# EasyEDA Pro project ESP32_BT-WiFi_Board.eprj

# Schematic MyTouchPad

## Sheets
1 主控最小系统: Create Date: 2024-08-18; Page Name: 主控最小系统; Project Name: ESP32_BT-WiFi_Board; Schematic Name: MyTouchPad; Update Date: 2024-08-21; Company: 嘉立创EDA; Page Size: A4; Version: V1.0
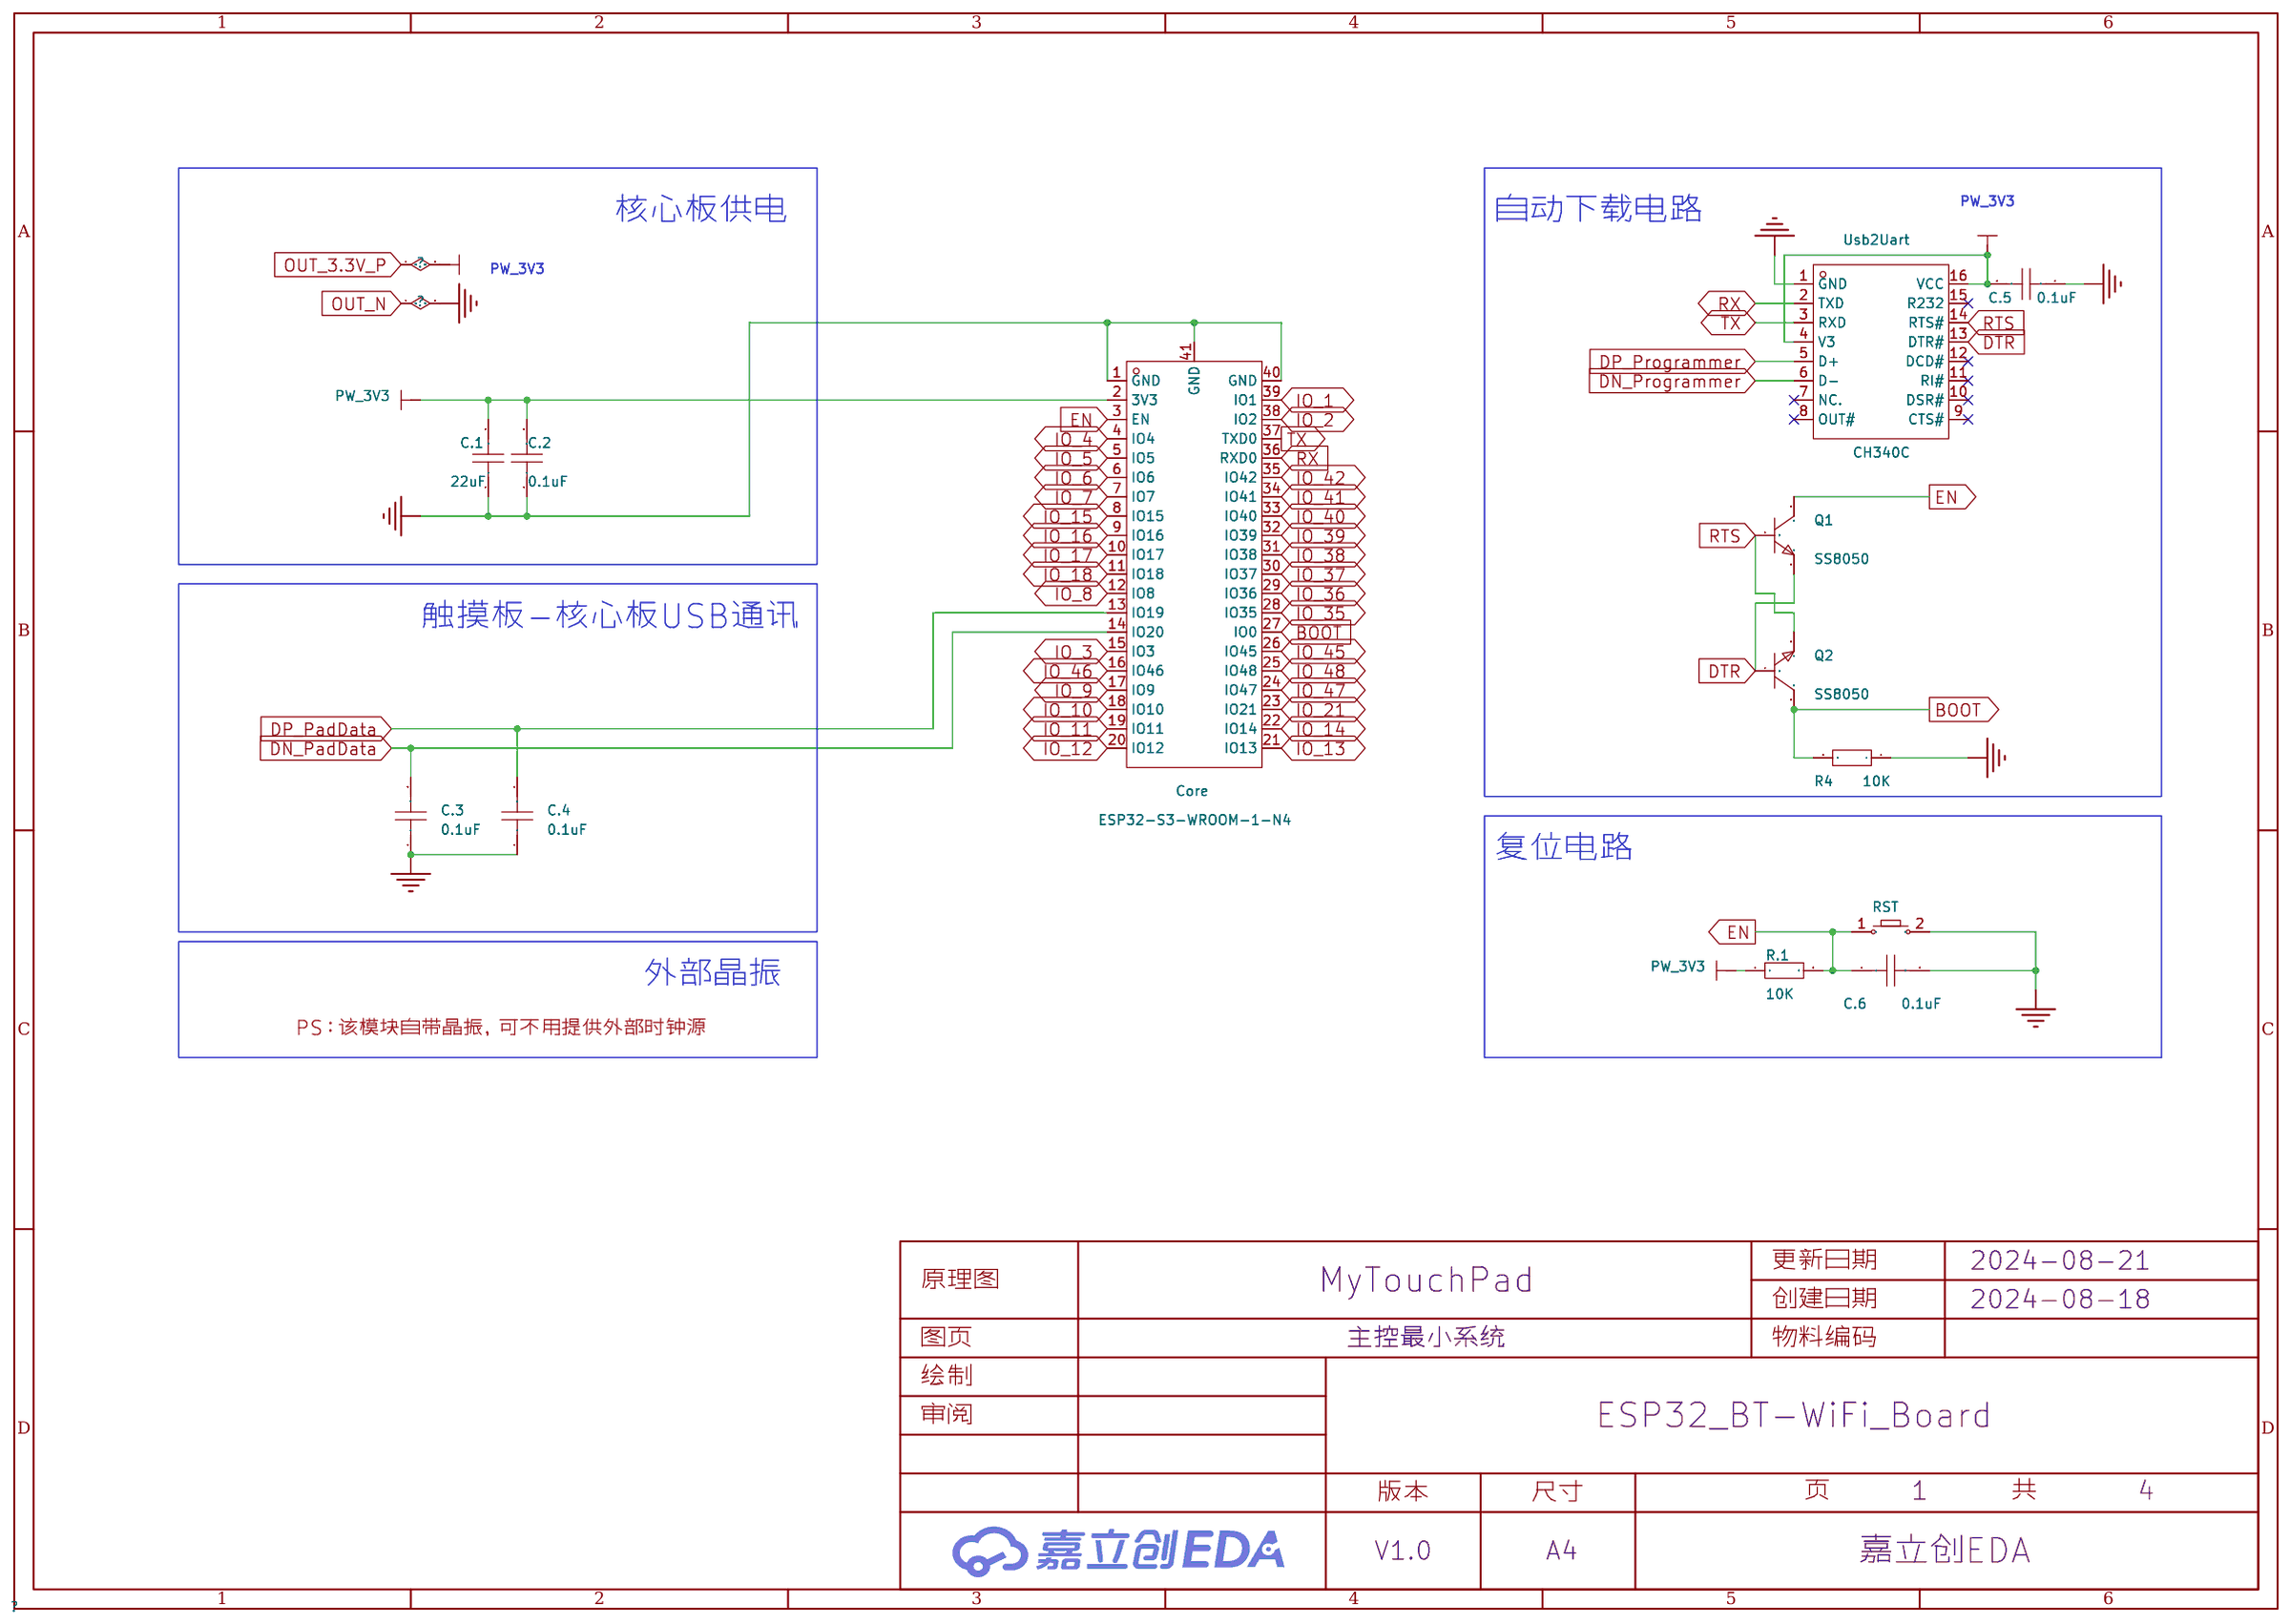
[diagram p0: 主控最小系统]
2 供电源: Page Name: 供电源; Update Date: 2024-08-19
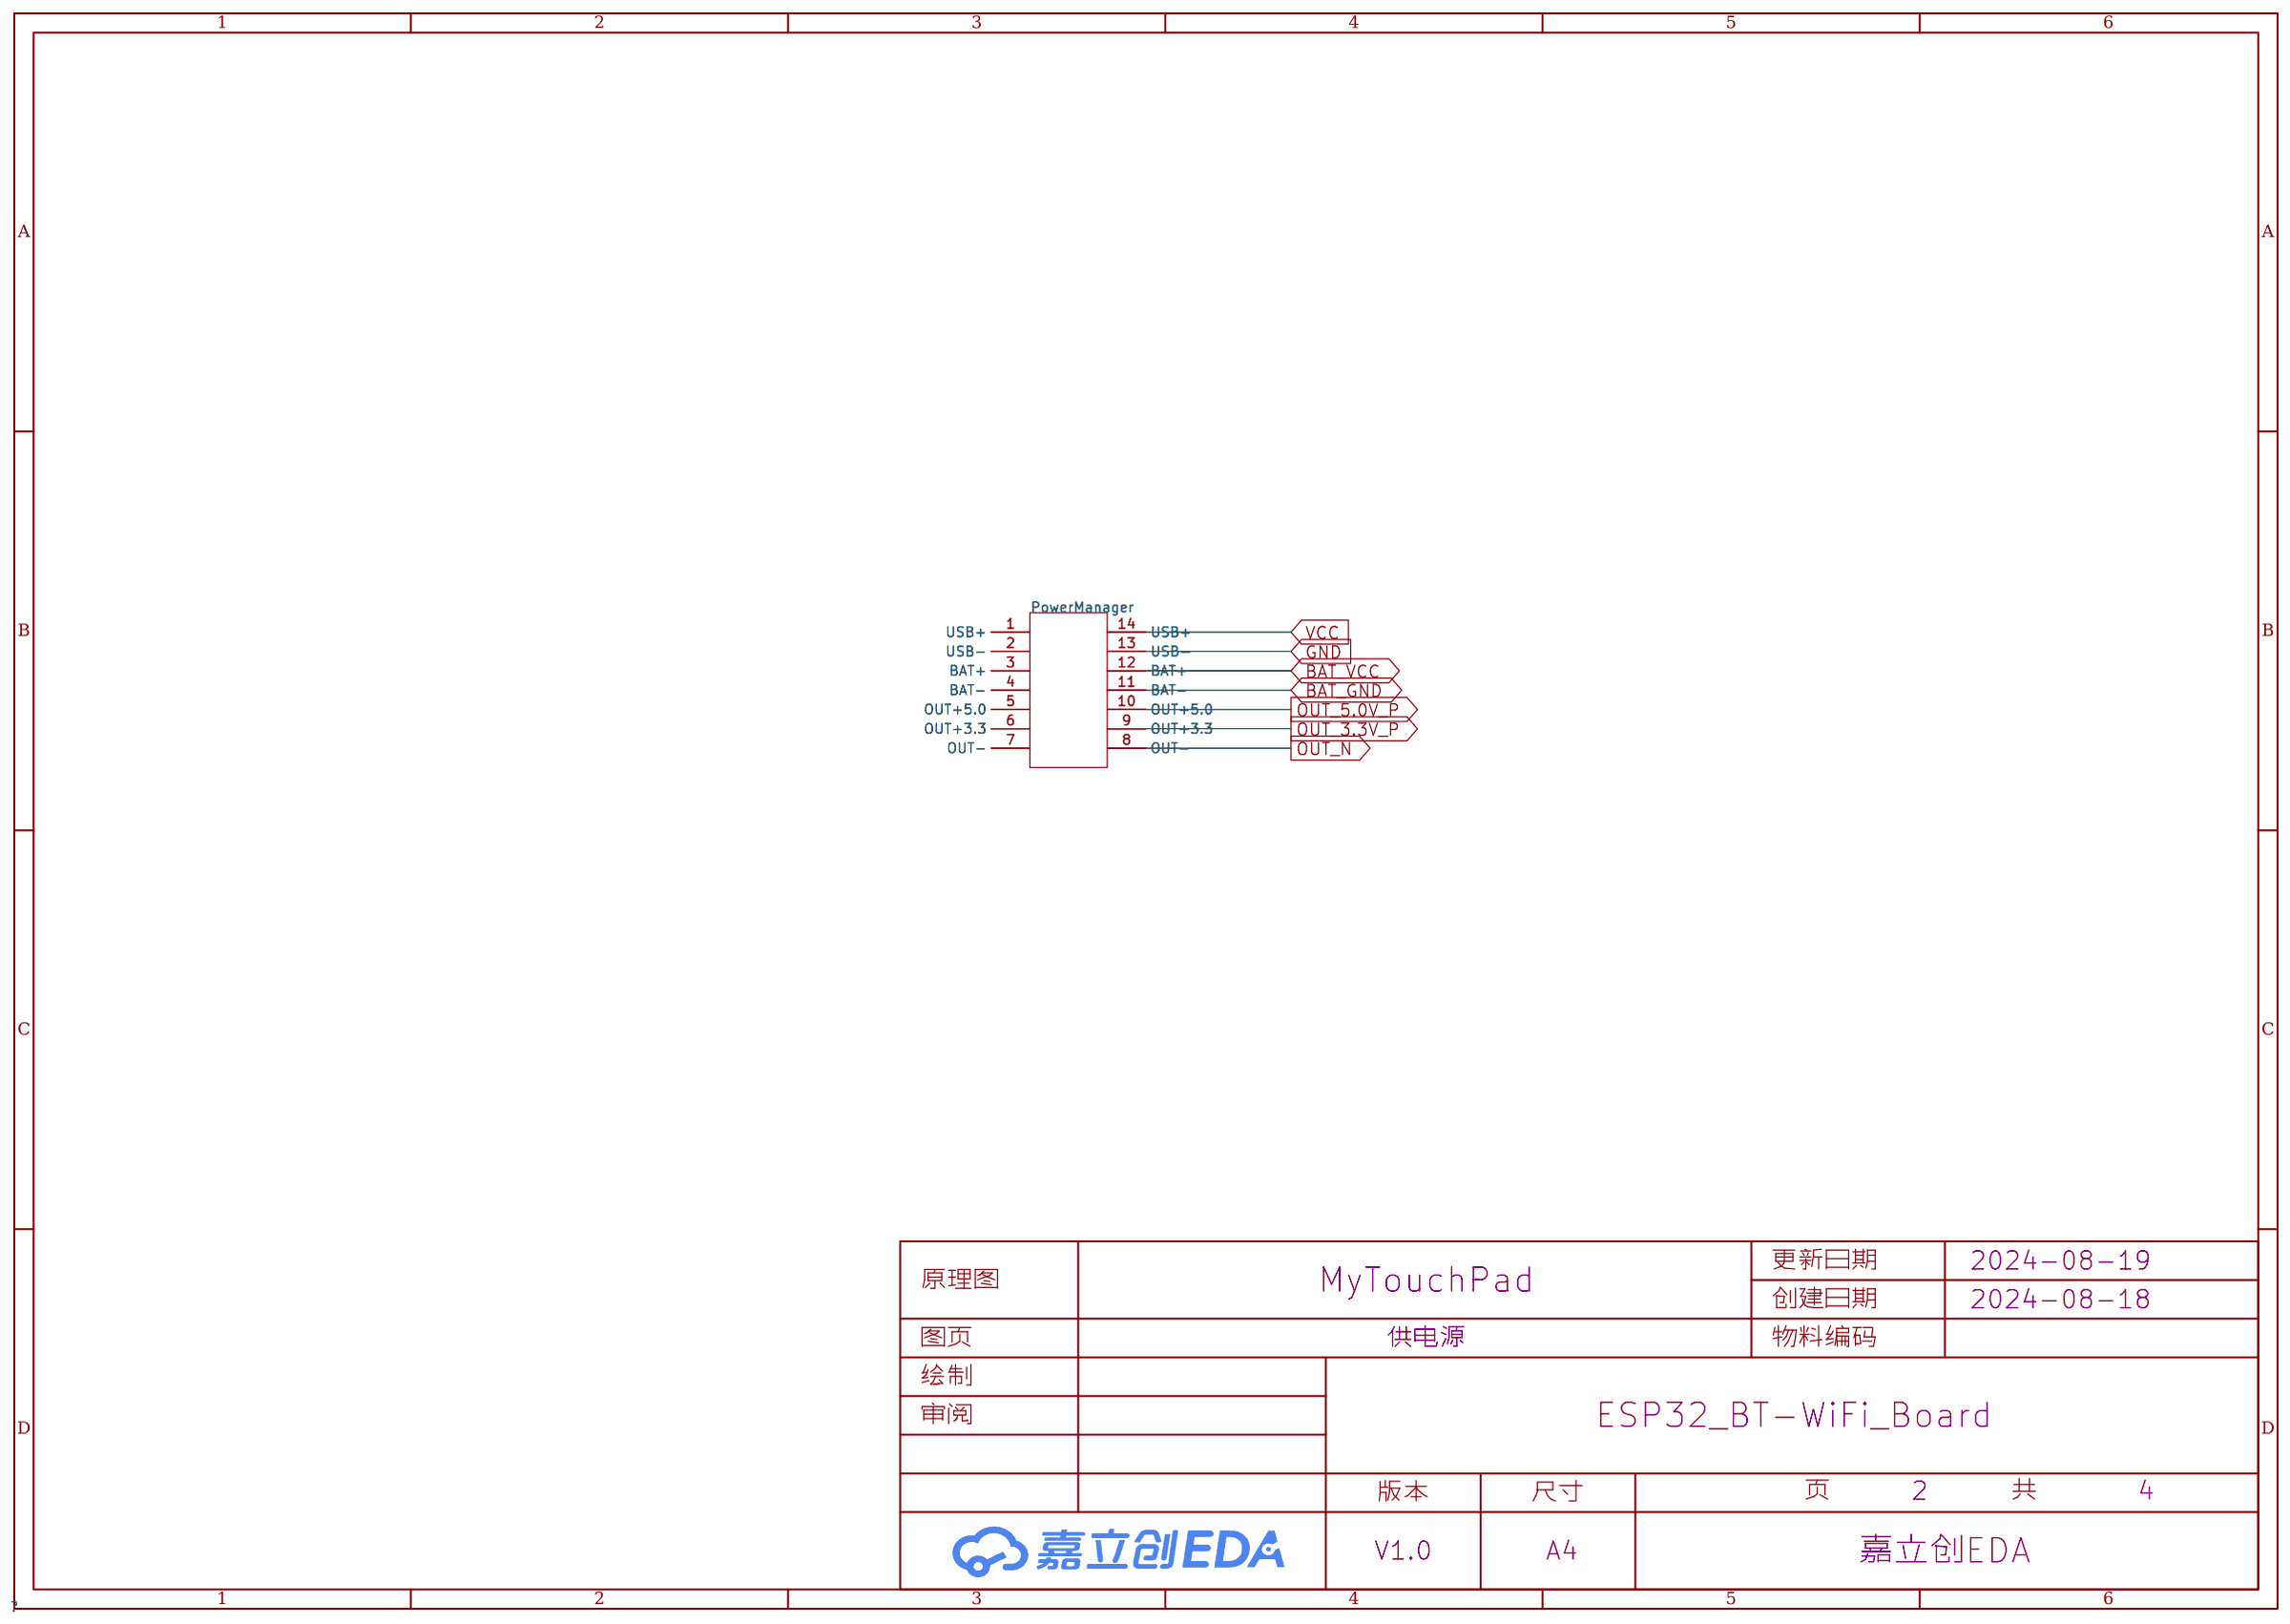
[diagram p1: 供电源]
3 触摸板模块: Page Name: 触摸板模块
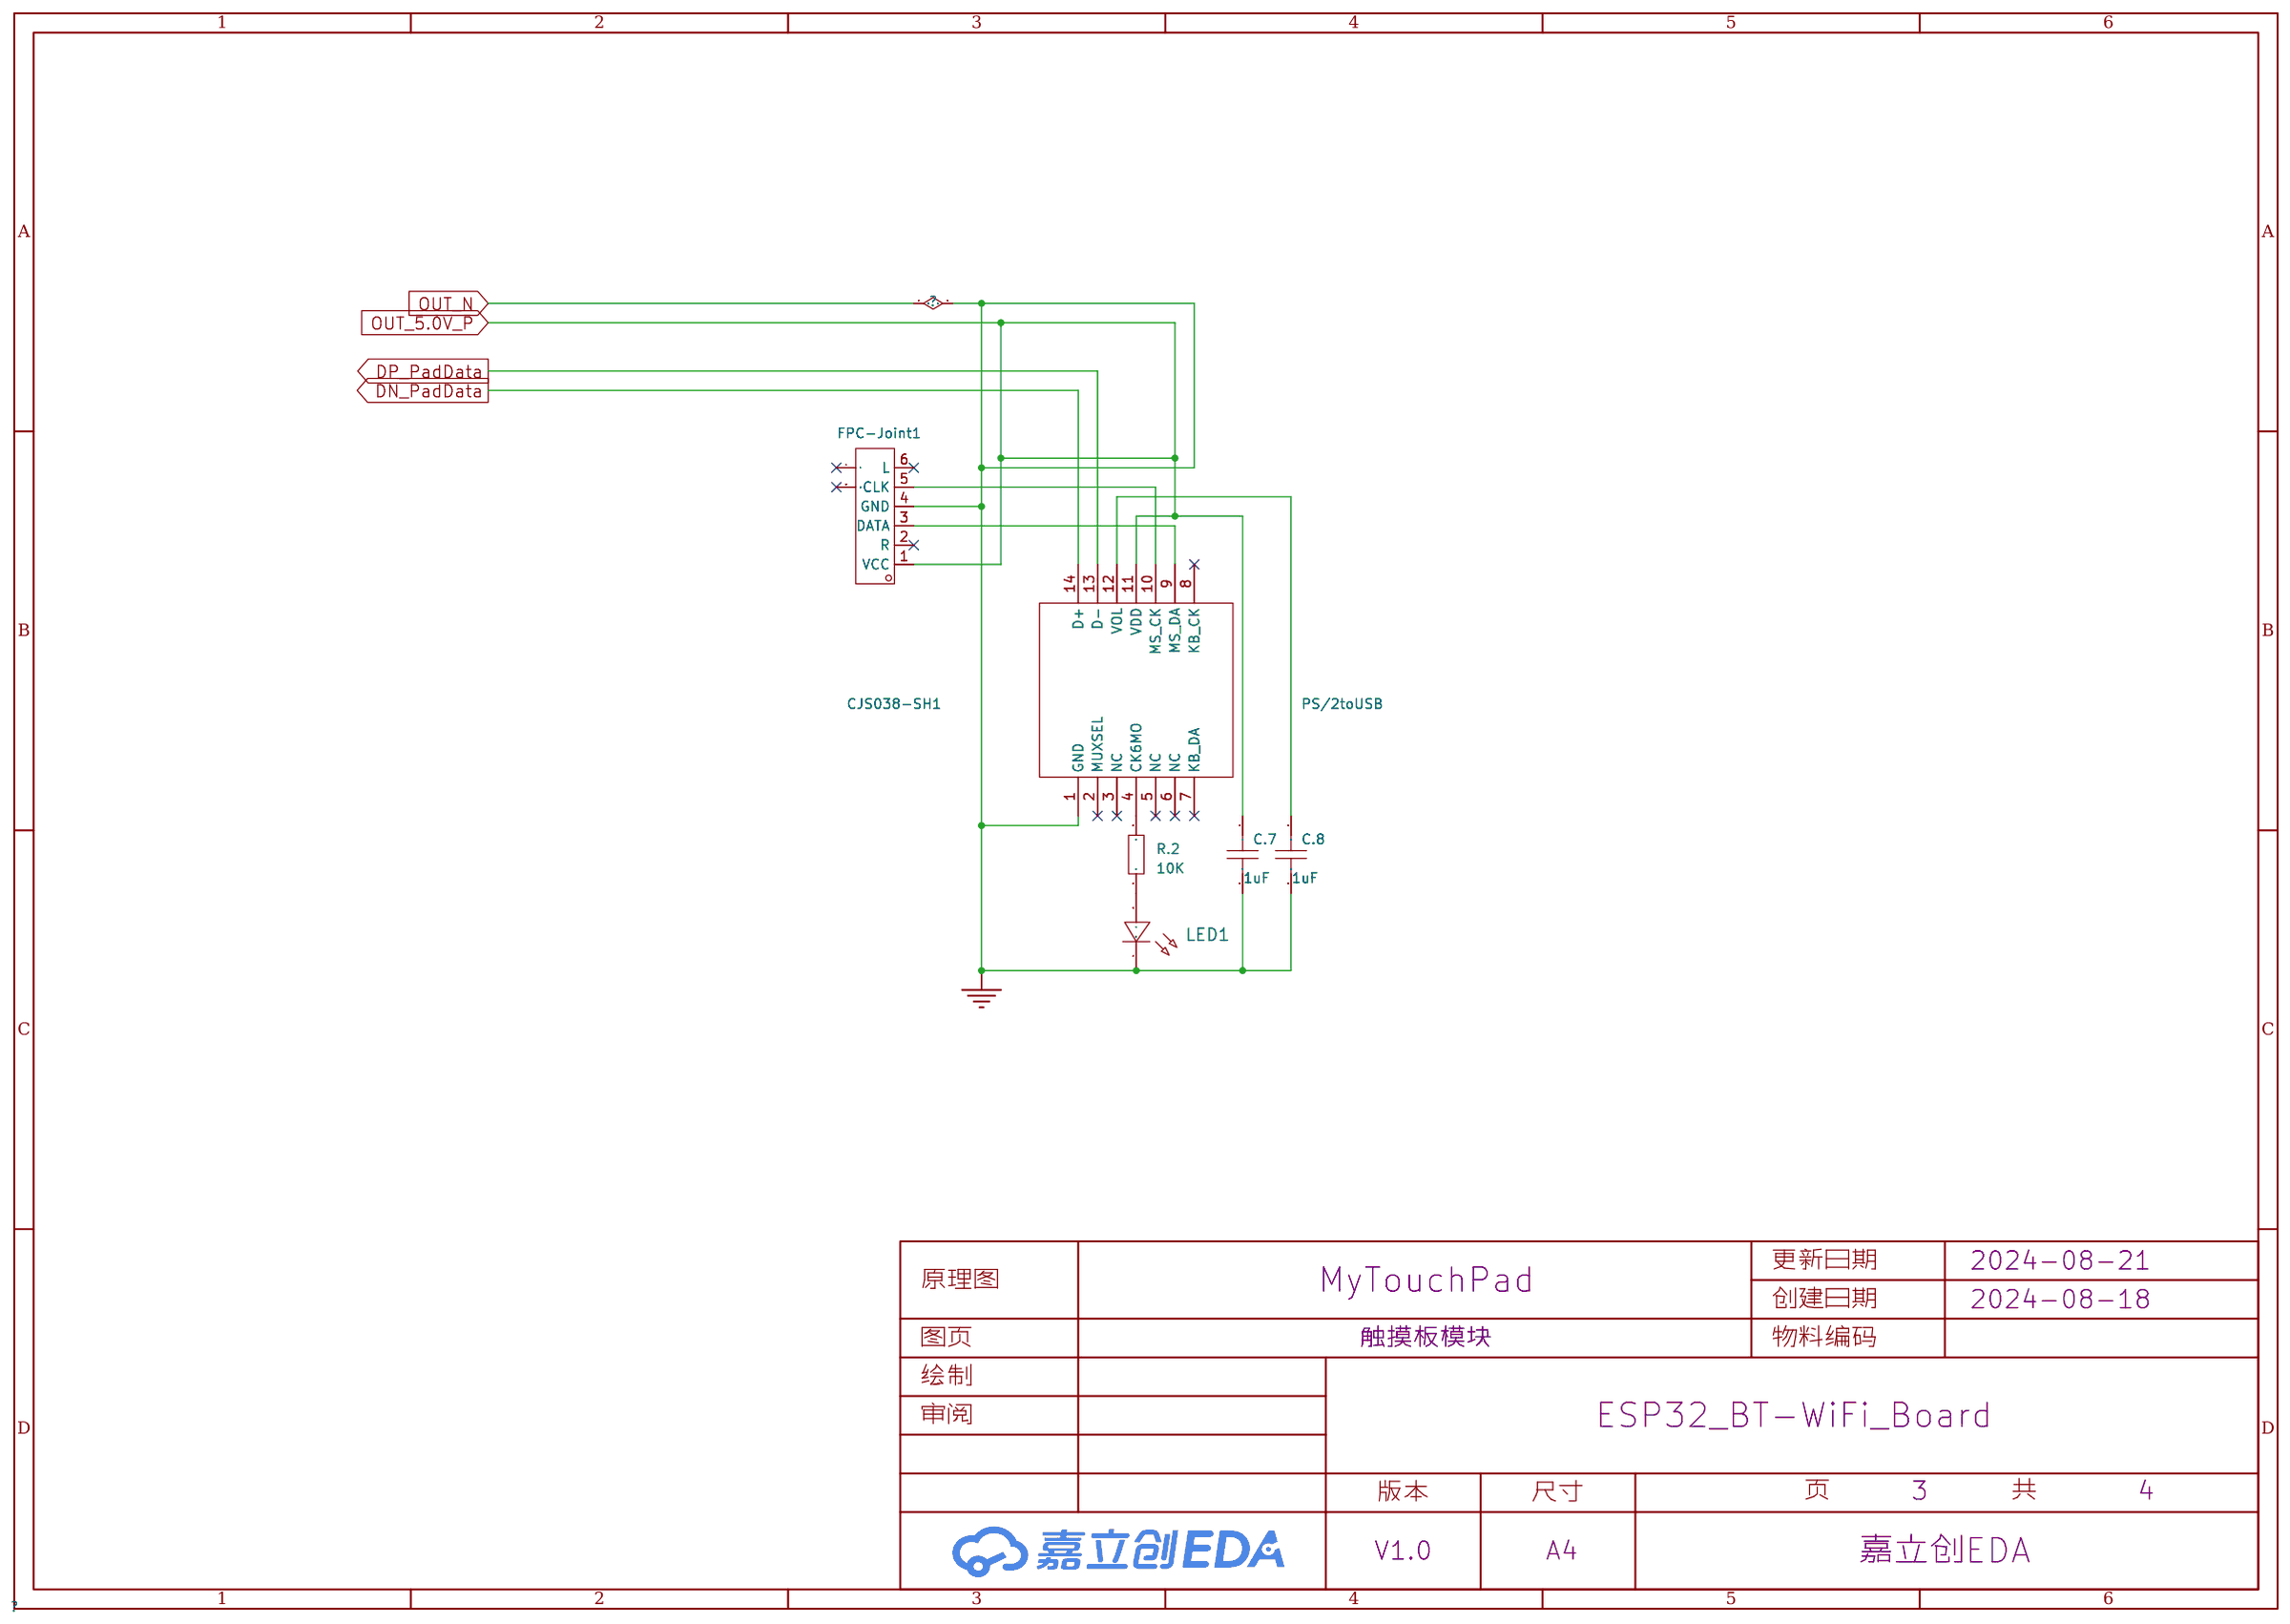
[diagram p2: 触摸板模块]
4 其它外设: Page Name: 其它外设
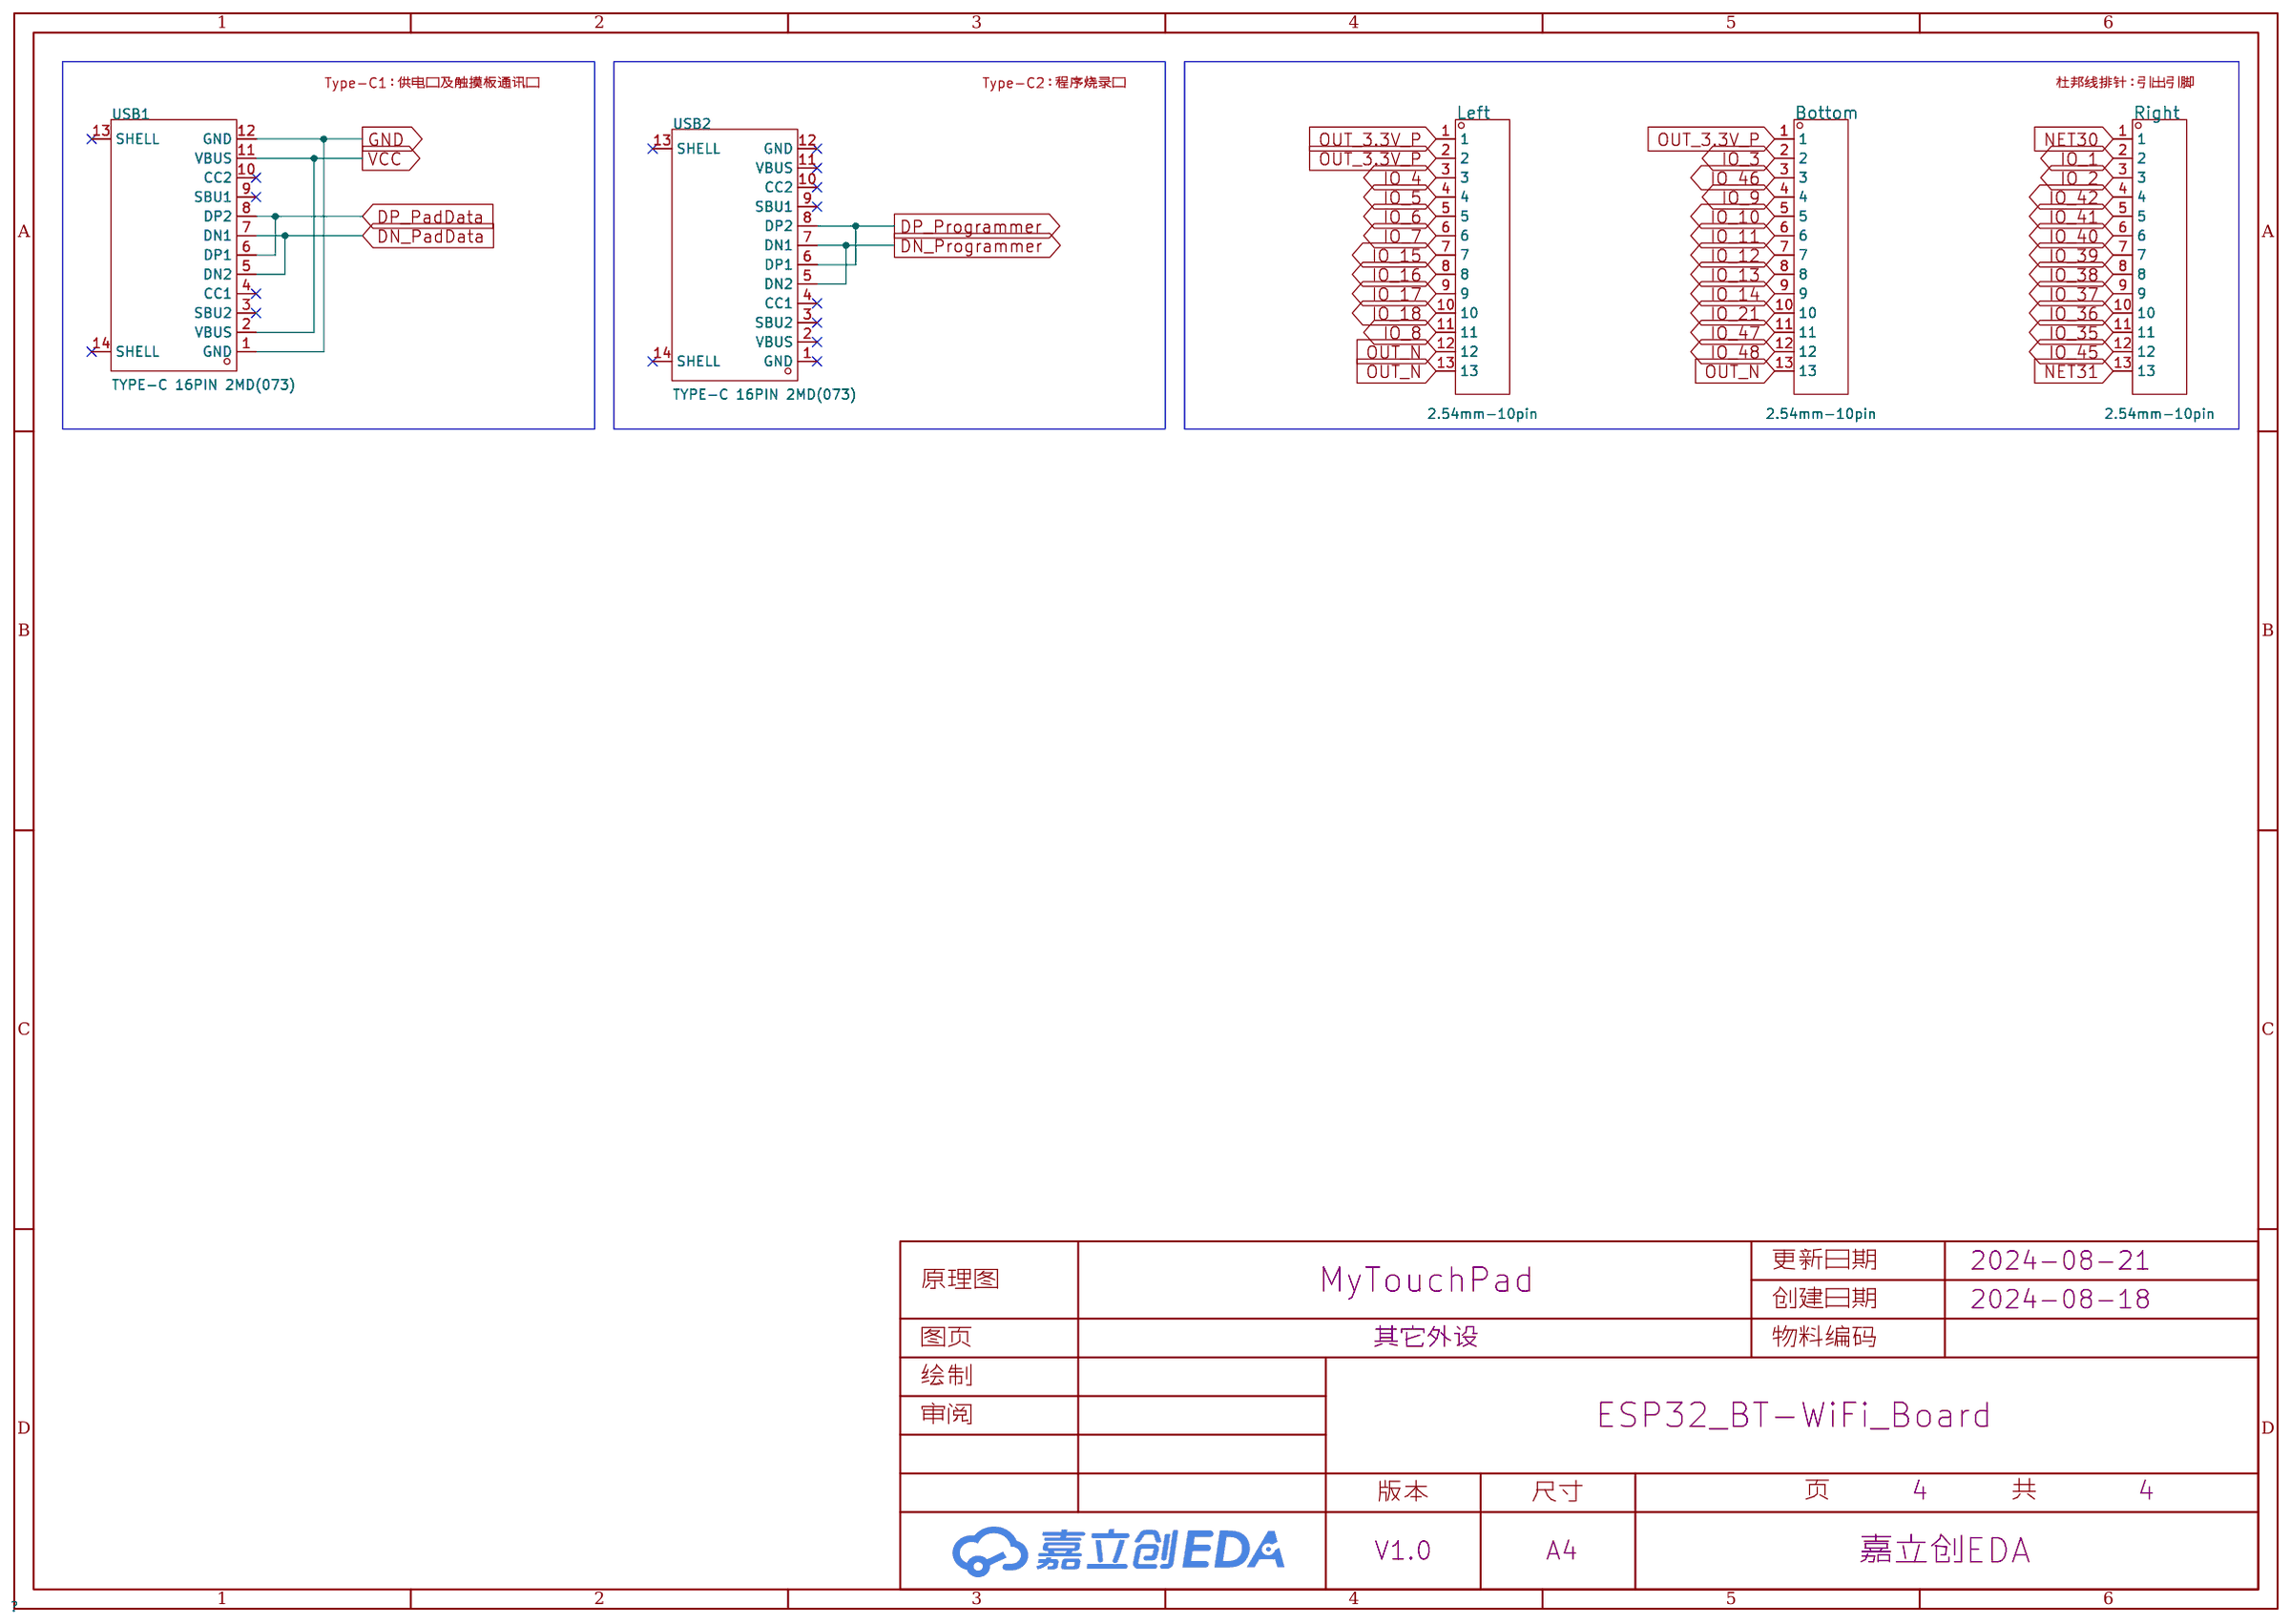
[diagram p3: 其它外设]

## Parts
sheet 主控最小系统
C.1  22uF  [C0603]
C.2  0.1uF  [C0603]
C.3  0.1uF  [C0603]
C.4  0.1uF  [C0603]
C.5  0.1uF  [C0603]
C.6  0.1uF  [C0603]
Core  ESP32-S3-WROOM-1-N4  [WIFIM-SMD_ESP32-S3-WROOM-1-N8]
Q1  SS8050  [SOT-23-3_L2.9-W1.3-P1.90-LS2.4-BR]
Q2  SS8050  [SOT-23-3_L2.9-W1.3-P1.90-LS2.4-BR]
R4  10K  [R0603]
R.1  10K  [R0603]
RST  -  [Key_SMD_3x4x2]
Usb2Uart  CH340C  [SOP-16_L10.0-W3.9-P1.27-LS6.0-BL]
sheet 供电源
PowerManager  -  [PowerManager]
sheet 其它外设
Bottom  2.54mm-10pin  [HDR-TH_13P-P2.54-H-M-W10.0]
Left  2.54mm-10pin  [HDR-TH_13P-P2.54-H-M-W10.0]
Right  2.54mm-10pin  [HDR-TH_13P-P2.54-H-M-W10.0]
USB1  TYPE-C 16PIN 2MD(073)  [USB-C-SMD_TYPE-C-6PIN-2MD-073]
USB2  TYPE-C 16PIN 2MD(073)  [USB-C-SMD_TYPE-C-6PIN-2MD-073]
sheet 触摸板模块
C.7  1uF  [C0603]
C.8  1uF  [C0603]
CJS038-SH1  PS/2toUSB  [CJS038-SH]
FPC-Joint1  VCC  [FPC-SMD_C47271]
LED1  -  [LED_0603]
R.2  10K  [R0603]

## Library data of the parts
C.1-C.8 = CAP_0603: Supplier Footprint: 0603
Core = ESP32-S3-WROOM-1-N4: LCSC Part Name: 通用型Wi-Fi+低功耗蓝牙MCU模组; Supplier Part: C2913197; Manufacturer: ESPRESSIF(乐鑫); Supplier Footprint: SMD,18x25.5mm; JLCPCB Part Class: 扩展库; Datasheet: https://atta.szlcsc.com/upload/public/pdf/source/20220628/A2AC12B3C87735CAEB7EBE2DBE80936C.pdf; Supplier: LCSC
Q1 Q2 = SS8050_C2150: 晶体管类型:NPN;集电极电流(Ic):1.5A;集射极击穿电压(Vceo):25V;功率(Pd):300mW;直流电流增益(hFE@Ic,Vce):200@100mA,1V;; LCSC Part Name: SS8050(RANGE:200-350) hfe=200~350; Supplier Part: C2150; Manufacturer: CJ(江苏长电/长晶); Supplier Footprint: SOT-23; Datasheet: https://atta.szlcsc.com/upload/public/pdf/source/20230322/AEE86F4B043774EFF80CAEA14A37D9E9.pdf; Supplier: LCSC; Transistor Type: NPN; Collector Current (Ic): 1.5A; Collector-Emitter Breakdown Voltage (Vceo): 25V; Power Dissipation (Pd): 300mW; DC Current Gain (hFE@Ic,Vce): 200@100mA,1V; Transition Frequency (fT): 100MHz; Collector Cut-Off Current (Icbo): 100nA; Collector-Emitter Saturation Voltage (VCE(sat)@Ic,Ib): 500mV@800mA,80mA
R4 R.1 R.2 = Res_0603: Supplier Footprint: 0603
RST = Key_SMD_3x4x2: Supplier Footprint: SMD
Usb2Uart = CH340C: 应用功能:收发器;接口协议:USB 2.0;数据速率:2Mbps;; LCSC Part Name: CH340C USB转串口芯片 CH340; Supplier Part: C84681; Manufacturer: WCH(南京沁恒); Supplier Footprint: SOP-16; Datasheet: https://atta.szlcsc.com/upload/public/pdf/source/20200819/C84681_ADBED554CE321879DBD6B1D06488689C.pdf; Supplier: LCSC; Applications Function: 收发器; Protocol: USB 2.0; Supply Voltage: 3.3V；5V; Data Rate: 2Mbps
PowerManager = PowerManagerBoard
Bottom Left Right = 排针2.54: 插针结构:1x13P;间距:2.54mm;行距:-;圆针/方针:方针;安装类型:弯插;排数:单排;总PIN位数:13P;额定电流:-;额定电压:-;配合针长度:6.7mm;塑高:-;触头材质:黄铜;触头镀层:-;工作温度范围:-55℃~+105℃;颜色:黑色;; LCSC Part Name: 间距:2.54mm 1x13P 弯插 方针; Supplier Part: C53043; Manufacturer: BOOMELE(博穆精密); Supplier Footprint: 弯插,P=2.54mm; JLCPCB Part Class: 扩展库; Datasheet: https://atta.szlcsc.com/upload/public/pdf/source/20190227/C53043_9E66E3B03BAF8C9BE00E32CFB7075A29.pdf; Supplier: LCSC; Pin Structure: 1x13P; Pitch: 2.54mm; Circluar Pins/Square Pins: 方针; Mounting Type: 弯插; Number of Rows: 单排; Number of Pins: 13P; Length of Mating Pin: 6.7mm; Contact Material: 黄铜; Operating Temperature Range: -55℃~+105℃; Color: 黑色
USB1 USB2 = TYPE-C 16PIN 2MD(073): 连接器类型:Type-C;标准:-;公母:母;端口数量:1;触点数量:16P;安装方式:卧贴;额定电流 - 电源:5A;工作温度范围:-25℃~+85℃;; LCSC Part Name: Type-C 母 卧贴; Supplier Part: C2765186; Manufacturer: SHOU HAN(首韩); Supplier Footprint: SMD; Datasheet: https://atta.szlcsc.com/upload/public/pdf/source/20211123/39B17C16241EAC15C5E277BDA434118E.pdf; Supplier: LCSC; Connector Type: Type-C; Gender: 母; Number of Ports: 1; Number of Contacts: 16P; Mounting Style: 卧贴; Current Rating - Power (Max): 5A; Operating Temperature Range: -25℃~+85℃
CJS038-SH1 = CJS038-SH: 协议转换芯片，将PS/2信号转换成USB信号
FPC-Joint1 = 1.0-6P上接: 锁定特性:抽屉式;触点类型:上接;触点数量:6P;间距:1mm;安装类型:卧贴;工作温度范围:-25℃~+85℃;; LCSC Part Name: 间距:1mm P数:6P 抽屉式 上接; Supplier Part: C47271; Manufacturer: BOOMELE(博穆精密); Supplier Footprint: SMD,P=1mm,卧贴; Datasheet: https://atta.szlcsc.com/upload/public/pdf/source/20231027/443F616BA0A67C4DA05E58DE2BCDE40A.pdf; Supplier: LCSC; Locking Feature: 抽屉式; Contact Type: 上接; Number of Contacts: 6P; Pitch: 1mm; Mounting Type: 卧贴; FFC, FCB Thickness: 0.3mm; Height Above Board: 2.8mm; Operating Temperature Range: -25℃~+85℃
LED1 = LED_0603-R: Supplier Footprint: 0603

## Nets
GND: PowerManager.13(USB-) USB1.1(GND) USB1.12(GND)
VCC: PowerManager.14(USB+) USB1.2(VBUS) USB1.11(VBUS)
BAT_GND: PowerManager.11(BAT-)
BAT_VCC: PowerManager.12(BAT+)
BOOT: Core.27(IO0) Q2.3(C) R4.2
DN_PadData: C.3.2 CJS038-SH1.14(D+) Core.14(IO20) USB1.5(DN2) USB1.7(DN1)
DN_Programmer: USB2.5(DN2) USB2.7(DN1) Usb2Uart.6(D-)
DP_PadData: C.4.2 CJS038-SH1.13(D-) Core.13(IO19) USB1.6(DP1) USB1.8(DP2)
DP_Programmer: USB2.6(DP1) USB2.8(DP2) Usb2Uart.5(D+)
DTR: Q1.2(E) Q2.1(B) Usb2Uart.13(DTR#)
EN: C.6.1 Core.3(EN) Q1.3(C) R.1.2 RST.1
IO_1: Core.39(IO1) Right.2
IO_2: Core.38(IO2) Right.3
IO_3: Bottom.2 Core.15(IO3)
IO_4: Core.4(IO4) Left.3
IO_5: Core.5(IO5) Left.4
IO_6: Core.6(IO6) Left.5
IO_7: Core.7(IO7) Left.6
IO_8: Core.12(IO8) Left.11
IO_9: Bottom.4 Core.17(IO9)
IO_10: Bottom.5 Core.18(IO10)
IO_11: Bottom.6 Core.19(IO11)
IO_12: Bottom.7 Core.20(IO12)
IO_13: Bottom.8 Core.21(IO13)
IO_14: Bottom.9 Core.22(IO14)
IO_15: Core.8(IO15) Left.7
IO_16: Core.9(IO16) Left.8
IO_17: Core.10(IO17) Left.9
IO_18: Core.11(IO18) Left.10
IO_21: Bottom.10 Core.23(IO21)
IO_35: Core.28(IO35) Right.11
IO_36: Core.29(IO36) Right.10
IO_37: Core.30(IO37) Right.9
IO_38: Core.31(IO38) Right.8
IO_39: Core.32(IO39) Right.7
IO_40: Core.33(IO40) Right.6
IO_41: Core.34(IO41) Right.5
IO_42: Core.35(IO42) Right.4
IO_45: Core.26(IO45) Right.12
IO_46: Bottom.3 Core.16(IO46)
IO_47: Bottom.11 Core.24(IO47)
IO_48: Bottom.12 Core.25(IO48)
NET30: Right.1
NET31: Right.13
OUT_5.0V_P: C.7.1 CJS038-SH1.11(VDD) FPC-Joint1.1(VCC) PowerManager.10(OUT+5.0)
PW_3V3: Bottom.1 C.1.2 C.2.2 C.5.2 Core.2(3V3) Left.1 Left.2 PowerManager.9(OUT+3.3) R.1.1 Usb2Uart.4(V3) Usb2Uart.16(VCC)
PW_GND: Bottom.13 C.1.1 C.2.1 C.3.1 C.4.1 C.5.1 C.6.2 C.7.2 C.8.2 CJS038-SH1.1(GND) Core.1(GND) Core.40(GND) Core.41(GND) FPC-Joint1.4(GND) LED1.1(C) Left.12 Left.13 PowerManager.8(OUT-) R4.1 RST.2 Usb2Uart.1(GND)
RTS: Q1.1(B) Q2.2(E) Usb2Uart.14(RTS#)
RX: Core.36(RXD0) Usb2Uart.2(TXD)
TX: Core.37(TXD0) Usb2Uart.3(RXD)
$3N416: CJS038-SH1.10(MS_CK) FPC-Joint1.5(CLK)
$3N417: CJS038-SH1.9(MS_DA) FPC-Joint1.3(DATA)
Net-(C.8-1): C.8.1 CJS038-SH1.12(VOL)
Net-(CJS038-SH1-4): CJS038-SH1.4(CK6MO) R.2.2
Net-(LED1-2): LED1.2(A) R.2.1

Not connected (* = marked no-connect by the designer): CJS038-SH1 2(MUXSEL)* 3(NC)* 5(NC)* 6(NC)* 7(KB_DA)* 8(KB_CK)*; FPC-Joint1 2(R)* 6(L)* 7* 8*; PowerManager 1(USB+) 2(USB-) 3(BAT+) 4(BAT-) 5(OUT+5.0) 6(OUT+3.3) 7(OUT-); USB1 3(SBU2)* 4(CC1)* 9(SBU1)* 10(CC2)* 13(SHELL)* 14(SHELL)*; USB2 1(GND)* 2(VBUS)* 3(SBU2)* 4(CC1)* 9(SBU1)* 10(CC2)* 11(VBUS)* 12(GND)* 13(SHELL)* 14(SHELL)*; Usb2Uart 7(NC.)* 8(OUT#)* 9(CTS#)* 10(DSR#)* 11(RI#)* 12(DCD#)* 15(R232)*

## Notes on the sheets
sheet 1
- 核心板供电
- 自动下载电路
- 触摸板-核心板USB通讯
- 复位电路
- 外部晶振
- PS：该模块自带晶振，可不用提供外部时钟源
sheet 4
- Type-C1：供电口及触摸板通讯口
- Type-C2：程序烧录口
- 杜邦线排针：引出引脚

# Schematic PowerManager
Create Date: 2024-08-25; Page Name: PowerManager; Project Name: ESP32_BT-WiFi_Board; Schematic Name: PowerManager; Update Date: 2024-08-25; Company: 嘉立创EDA; Page Size: A4; Version: V1.0
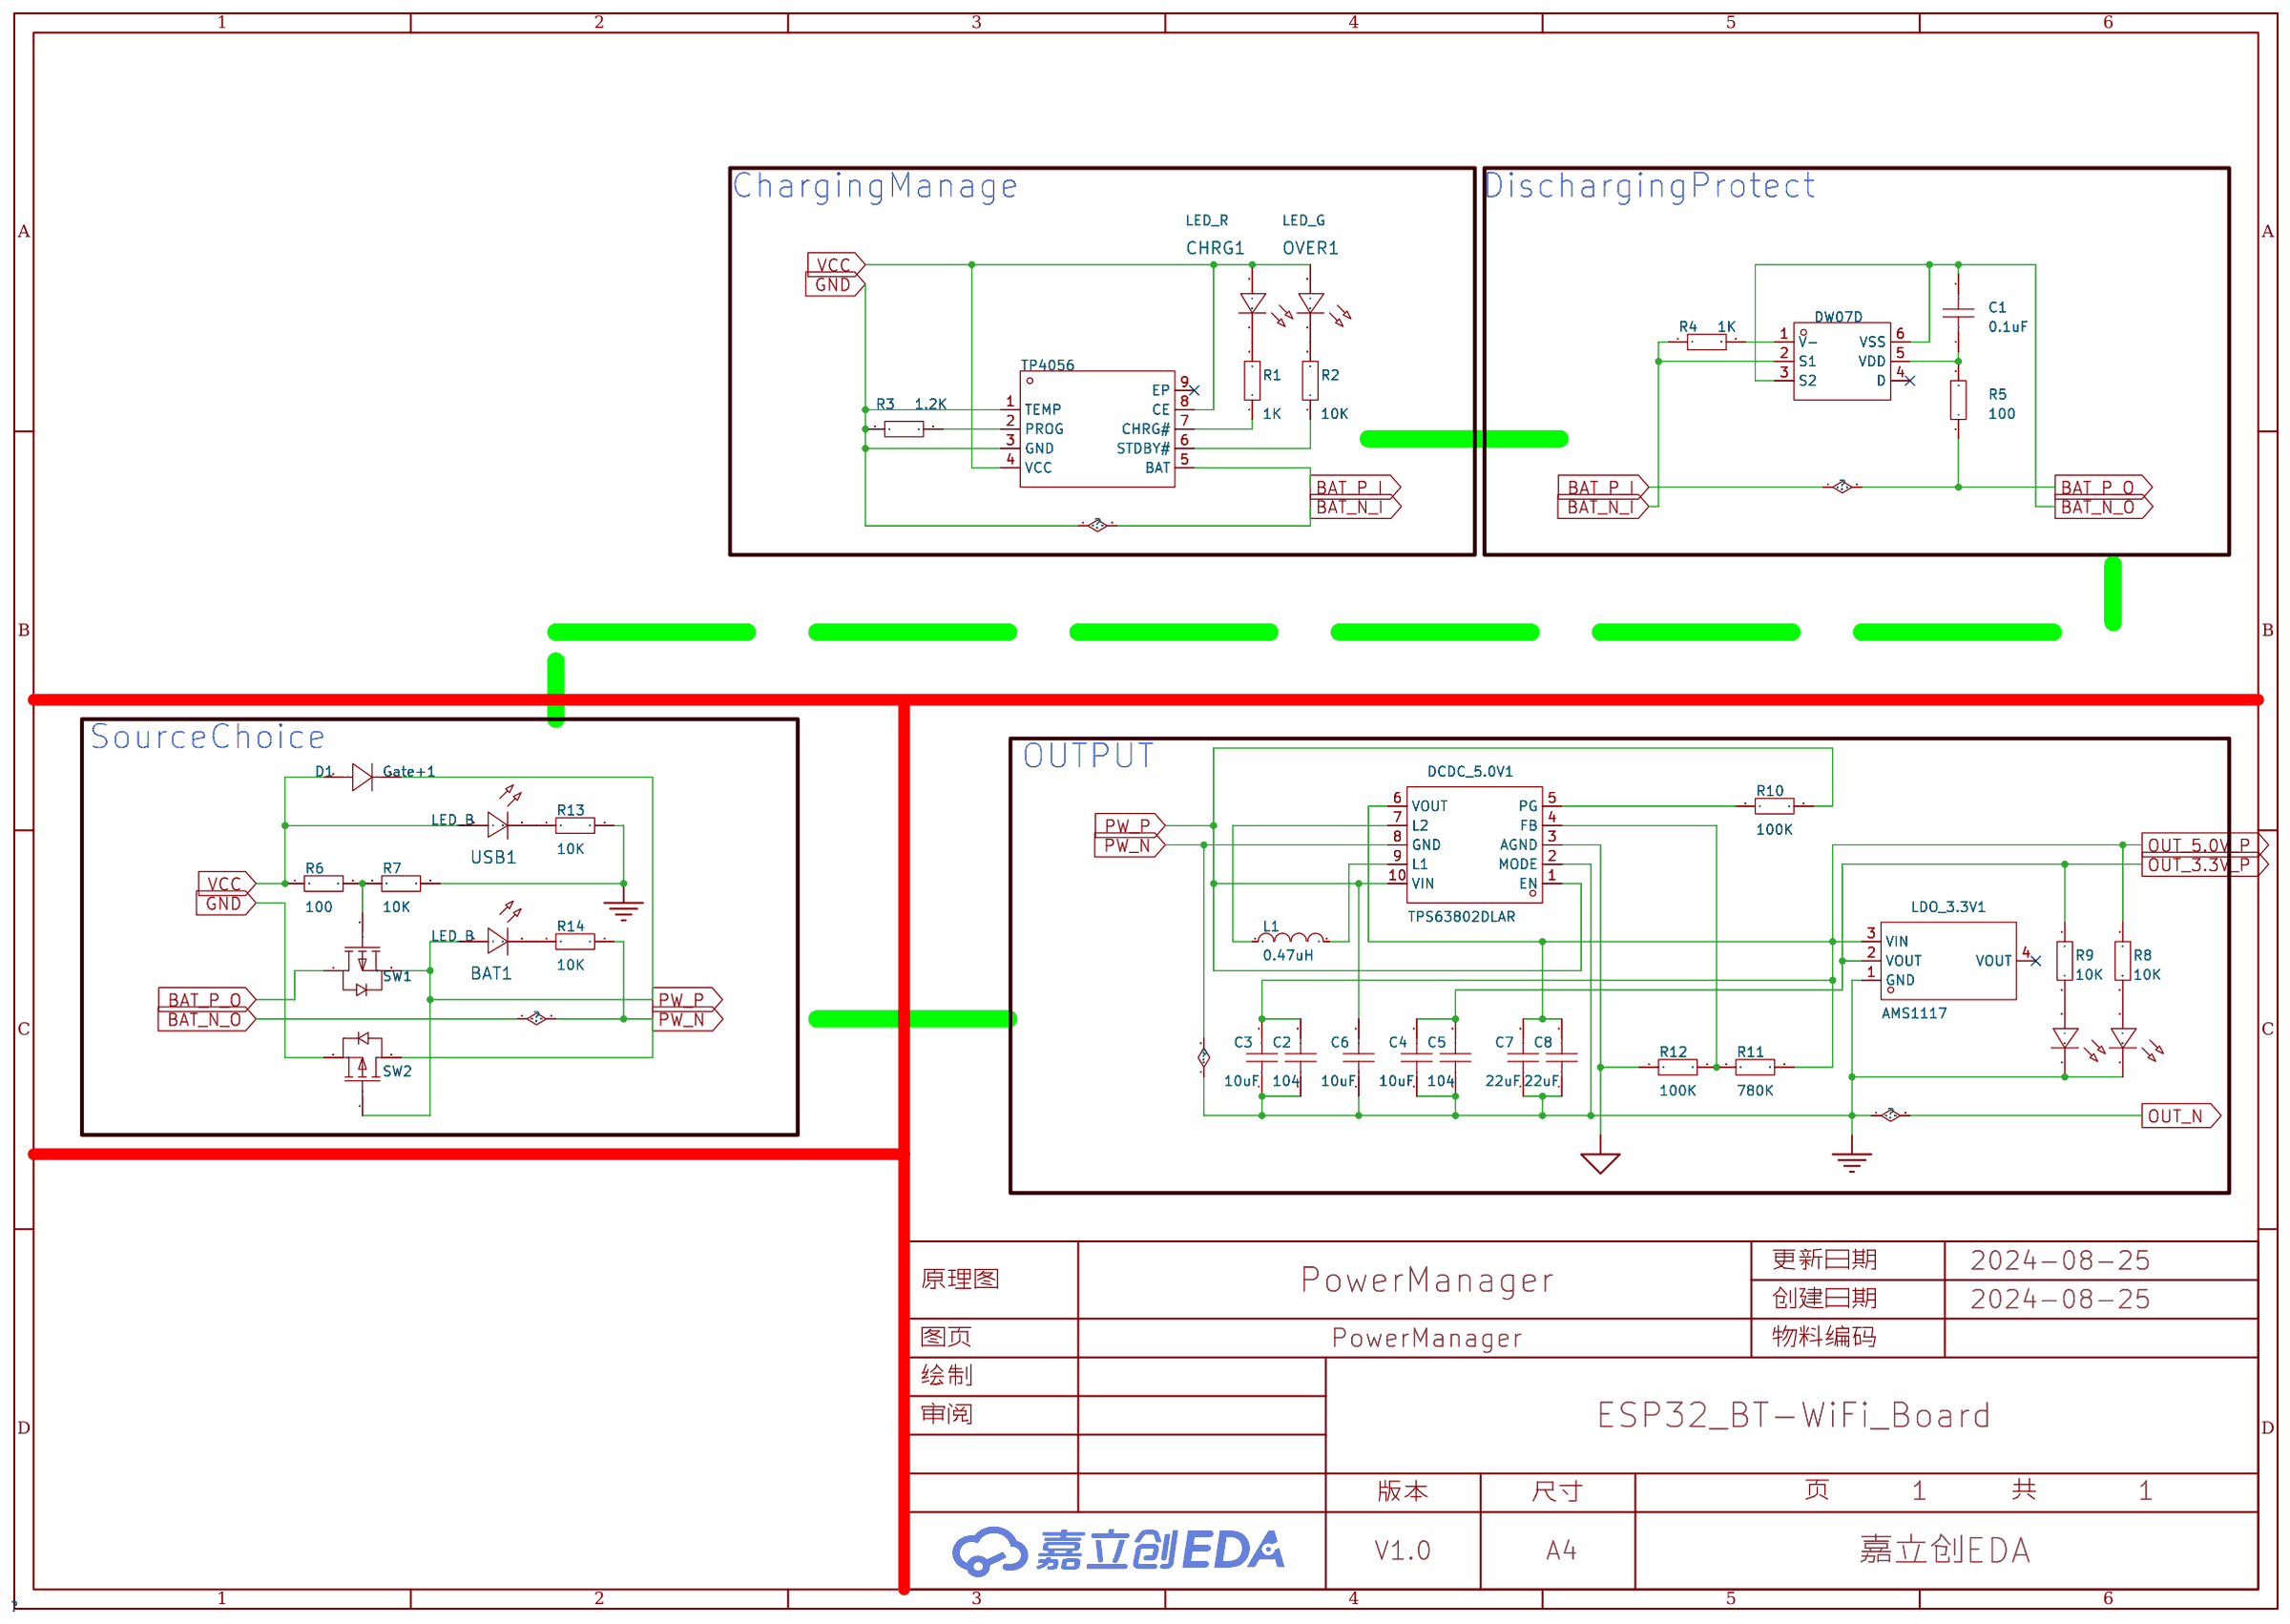
[diagram p4: schematic sheet]

## Parts
3.3V1  XL-1608UWC-04  [LED0603-RD_WHITE]
5.0V1  XL-1608UWC-04  [LED0603-RD_WHITE]
BAT1  LED_B  [LED0603-RD_BLUE]
C1  0.1uF  [C0603]
C2  104  [C0603]
C3  10uF  [C0603]
C4  104  [C0603]
C5  10uF  [C0603]
C6  10uF  [C0603]
C7  22uF  [C0603]
C8  22uF  [C0603]
CHRG1  LED_R  [LED_0603]
DCDC_5.0V1  TPS63802DLAR  [VSON-10_L3.0-W2.0-P0.50-TL]
Gate+1  D1  [SMA_1N4007]
L1  0.47uH  [L0603]
LDO_3.3V1  AMS1117  [SOT-223-3_L6.5-W3.4-P2.30-LS7.0-BR]
OVER1  LED_G  [LED0603-RD_GREEN]
R1  1K  [R0603]
R2  10K  [R0603]
R3  1.2K  [R0603]
R4  1K  [R0603]
R5  100  [R0603]
R6  100  [R0603]
R7  10K  [R0603]
R8  10K  [R0603]
R9  10K  [R0603]
R10  100K  [R0603]
R11  780K  [R0603]
R12  100K  [R0603]
R13  10K  [R0603]
R14  10K  [R0603]
SW1  AO3401A  [SOT-23_L2.9-W1.3-P1.90-LS2.4-BR]
SW2  AO3401A  [SOT-23_L2.9-W1.3-P1.90-LS2.4-BR]
TP4056  TP4056  [ESOP-8_L4.9-W3.9-P1.27-LS6.0-BL-EP]
U1  DW07D  [SOT-23-6_L2.9-W1.6-P0.95-LS2.8-BR]
USB1  LED_B  [LED0603-RD_BLUE]

## Library data of the parts
3.3V1 5.0V1 = XL-1608UWC-04: 发光颜色:白色;功率:80mW;正向电流:25mA;主波长:-;透镜颜色:黄色透镜;色温:13700K~19000K;发光角度:120°;载带方式:正贴;工作温度:-30℃~+85℃;; Supplier Part: C965808; Manufacturer: XINGLIGHT(成兴光); Supplier Footprint: 0603; JLCPCB Part Class: Extended Part; Datasheet: https://atta.szlcsc.com/upload/public/pdf/source/20221102/585FFDAF9A16AAB1CA7BDF9640D81A72.pdf; Supplier: LCSC; Emitted Color: 白色; Power Dissipation: 80mW; Forward Current: 25mA; Lens Color: 黄色透镜; Color Temperature: 13700K~19000K; Viewing Angle: 120°; Mounting Sytle: 正贴; Operating Temperature: -30℃~+85℃
BAT1 USB1 = XL-1608UBC-04: 发光颜色:蓝色;功率:80mW;正向电流:25mA;主波长:460nm~469nm;透镜颜色:无色透明透镜;色温:-;发光角度:120°;载带方式:正贴;工作温度:-30℃~+85℃;; Supplier Part: C965807; Manufacturer: XINGLIGHT(成兴光); Supplier Footprint: 0603; JLCPCB Part Class: Extended Part; Datasheet: https://atta.szlcsc.com/upload/public/pdf/source/20240218/F76B043D1CDACE9DB8357580572EF0D5.pdf; Supplier: LCSC; Emitted Color: 蓝色; Power Dissipation: 80mW; Forward Current: 25mA; Dominant Wavelength: 460nm~469nm; Peak Wavelength: 475nm; Lens Color: 无色透明透镜; Viewing Angle: 120°; Mounting Sytle: 正贴; Operating Temperature: -30℃~+85℃
C1-C8 = CAP_0603: Supplier Footprint: 0603
CHRG1 = LED_0603-R: Supplier Footprint: 0603
DCDC_5.0V1 = TPS63802DLAR_C2845237: Supplier Part: C2845237; Manufacturer: TI(德州仪器); Supplier Footprint: VSON-10(2x3); Datasheet: https://www.ti.com/cn/lit/gpn/tps63802; Supplier: LCSC
Gate+1 = D_1N4007: Supplier Footprint: SMA
L1 = L_0603
LDO_3.3V1 = AMS1117-3.3_C6186: 输出类型:固定;最大输入电压:-;输出电压:3.3V;最大输出电流:1A;电源纹波抑制比(PSRR):72dB@(120Hz);输出极性:正极;; LCSC Part Name: 输出3.3V 1A; Supplier Part: C6186; Manufacturer: AMS; Supplier Footprint: SOT-223; Datasheet: https://atta.szlcsc.com/upload/public/pdf/source/20180727/C6186_7A095716F0823C02F1997A905E26C086.pdf; Supplier: LCSC; Output Type: 固定; Output Voltage: 3.3V; MAX Output Current: 1A; Power Supply Rejection Ratio (PSRR): 72dB@(120Hz); Dropout Voltage: 1.3V@(800mA); Output Polarity: 正极; Number of Outputs: 1
OVER1 = XL-1608UGC-04: 灯头类型:-;发光颜色:翠绿色;正向电压(VF):-;功率:80mW;正向电流:25mA;主波长:516nm~525nm;二极管配置:独立二极管;透镜颜色:无色透明透镜;色温:-;发光强度:-;发光角度:120°;载带方式:正贴;工作温度:-30℃~+85℃;; Supplier Part: C965804; Manufacturer: XINGLIGHT(成兴光); Manufacturer Part: LED_R; Supplier Footprint: 0603; JLCPCB Part Class: Extended Part; Datasheet: https://atta.szlcsc.com/upload/public/pdf/source/20221102/520D6E465E5CFD1609C8A4DBC80D4018.pdf; Supplier: LCSC; Emitted Color: 翠绿色; Power Dissipation: 80mW; Forward Current: 25mA; Dominant Wavelength: 516nm~525nm; Peak Wavelength: 534nm; Diode Configuration: 独立二极管; Lens Color: 无色透明透镜; Viewing Angle: 120°; Mounting Sytle: 正贴; Operating Temperature: -30℃~+85℃
R1-R14 = Res_0603: Supplier Footprint: 0603
SW1 SW2 = AO3401A_C15127: 类型:1个P沟道;漏源电压(Vdss):30V;连续漏极电流(Id):4A;功率(Pd):1.4W;导通电阻(RDS(on)@Vgs,Id):44mΩ@10V,4.3A;阈值电压(Vgs(th)@Id):1.3V@250uA;; LCSC Part Name: 1个P沟道 耐压:30V 电流:4A; Supplier Part: C15127; Manufacturer: AOS; Supplier Footprint: SOT-23; Datasheet: https://atta.szlcsc.com/upload/public/pdf/source/20160507/1462613609053.pdf; Supplier: LCSC; Type: 1个P沟道; Drain Source Voltage (Vdss): 30V; Continuous Drain Current (Id): 4A; Power Dissipation (Pd): 1.4W; Drain Source On Resistance (RDS(on)@Vgs,Id): 44mΩ@10V,4.3A; Gate Threshold Voltage (Vgs(th)@Id): 1.3V@250uA; Total Gate Charge (Qg@Vgs): 12.2nC@4.5V; Input Capacitance (Ciss@Vds): 1.2nF@15V; Operating Temperature: -55℃~+150℃@(Tj)
TP4056 = TP4056_C725790: Supplier Part: C725790; Manufacturer: UMW(友台半导体); Supplier Footprint: ESOP-8; Datasheet: https://atta.szlcsc.com/upload/public/pdf/source/20231109/CF74897CE79A500F7FE27A45ADCCC631.pdf; Supplier: LCSC
U1 = DW07D: 二合一锂电池保护IC; Supplier Part: C89497; Manufacturer: FM(富满); Supplier Footprint: SOT-23-6; Datasheet: https://atta.szlcsc.com/upload/public/pdf/source/20161128/1480332603746.pdf; Supplier: LCSC

## Nets
AGND: DCDC_5.0V1.3(AGND) R12.1
DGND: 3.3V1.1(C) 5.0V1.1(C) C1.2 C2.1 C3.1 C4.1 C5.1 C6.1 C7.1 C8.1 DCDC_5.0V1.2(MODE) DCDC_5.0V1.8(GND) LDO_3.3V1.1(GND) R14.2 SW2.3(D) U1.3(S2) U1.6(VSS)
GND: R3.1 R4.1 R7.2 R13.2 SW2.2(S) TP4056.1(TEMP) TP4056.3(GND) U1.2(S1)
VCC: CHRG1.2(A) Gate+1.2(A) OVER1.2(A) R6.1 TP4056.4(VCC) TP4056.8(CE) USB1.2(A)
BAT_P_I: R5.1 SW1.3(D) TP4056.5(BAT)
OUT_3.3V_P: C4.2 C5.2 LDO_3.3V1.2(VOUT) R9.1
OUT_5.0V_P: C2.2 C3.2 C7.2 C8.2 DCDC_5.0V1.6(VOUT) LDO_3.3V1.3(VIN) R8.1 R11.2
PW_P: BAT1.2(A) C6.2 DCDC_5.0V1.1(EN) DCDC_5.0V1.10(VIN) Gate+1.1(K) R10.1 SW1.2(S) SW2.1(G)
$1N753: R3.2 TP4056.2(PROG)
$1N968: R1.1 TP4056.7(CHRG#)
$1N975: R2.1 TP4056.6(STDBY#)
$1N1874: R6.2 R7.1 SW1.1(G)
Net-(3.3V1-2): 3.3V1.2(A) R9.2
Net-(5.0V1-2): 5.0V1.2(A) R8.2
Net-(BAT1-1): BAT1.1(C) R14.1
Net-(C1-1): C1.1 R5.2 U1.5(VDD)
Net-(CHRG1-1): CHRG1.1(C) R1.2
Net-(DCDC_5.0V1-4): DCDC_5.0V1.4(FB) R11.1 R12.2
Net-(DCDC_5.0V1-5): DCDC_5.0V1.5(PG) R10.2
Net-(DCDC_5.0V1-7): DCDC_5.0V1.7(L2) L1.1
Net-(DCDC_5.0V1-9): DCDC_5.0V1.9(L1) L1.2
Net-(OVER1-1): OVER1.1(C) R2.2
Net-(R4-2): R4.2 U1.1(V-)
Net-(R13-1): R13.1 USB1.1(C)

Not connected (* = marked no-connect by the designer): LDO_3.3V1 4(VOUT)*; TP4056 9(EP)*; U1 4(D)*

## Notes on the sheet
- ChargingManage
- DischargingProtect
- SourceChoice
- OUTPUT

# Schematic TestBoard
Create Date: 2024-08-25; Page Name: TestBoard; Project Name: ESP32_BT-WiFi_Board; Schematic Name: TestBoard; Update Date: 2024-08-25; Company: 嘉立创EDA; Page Size: A4; Version: V1.0
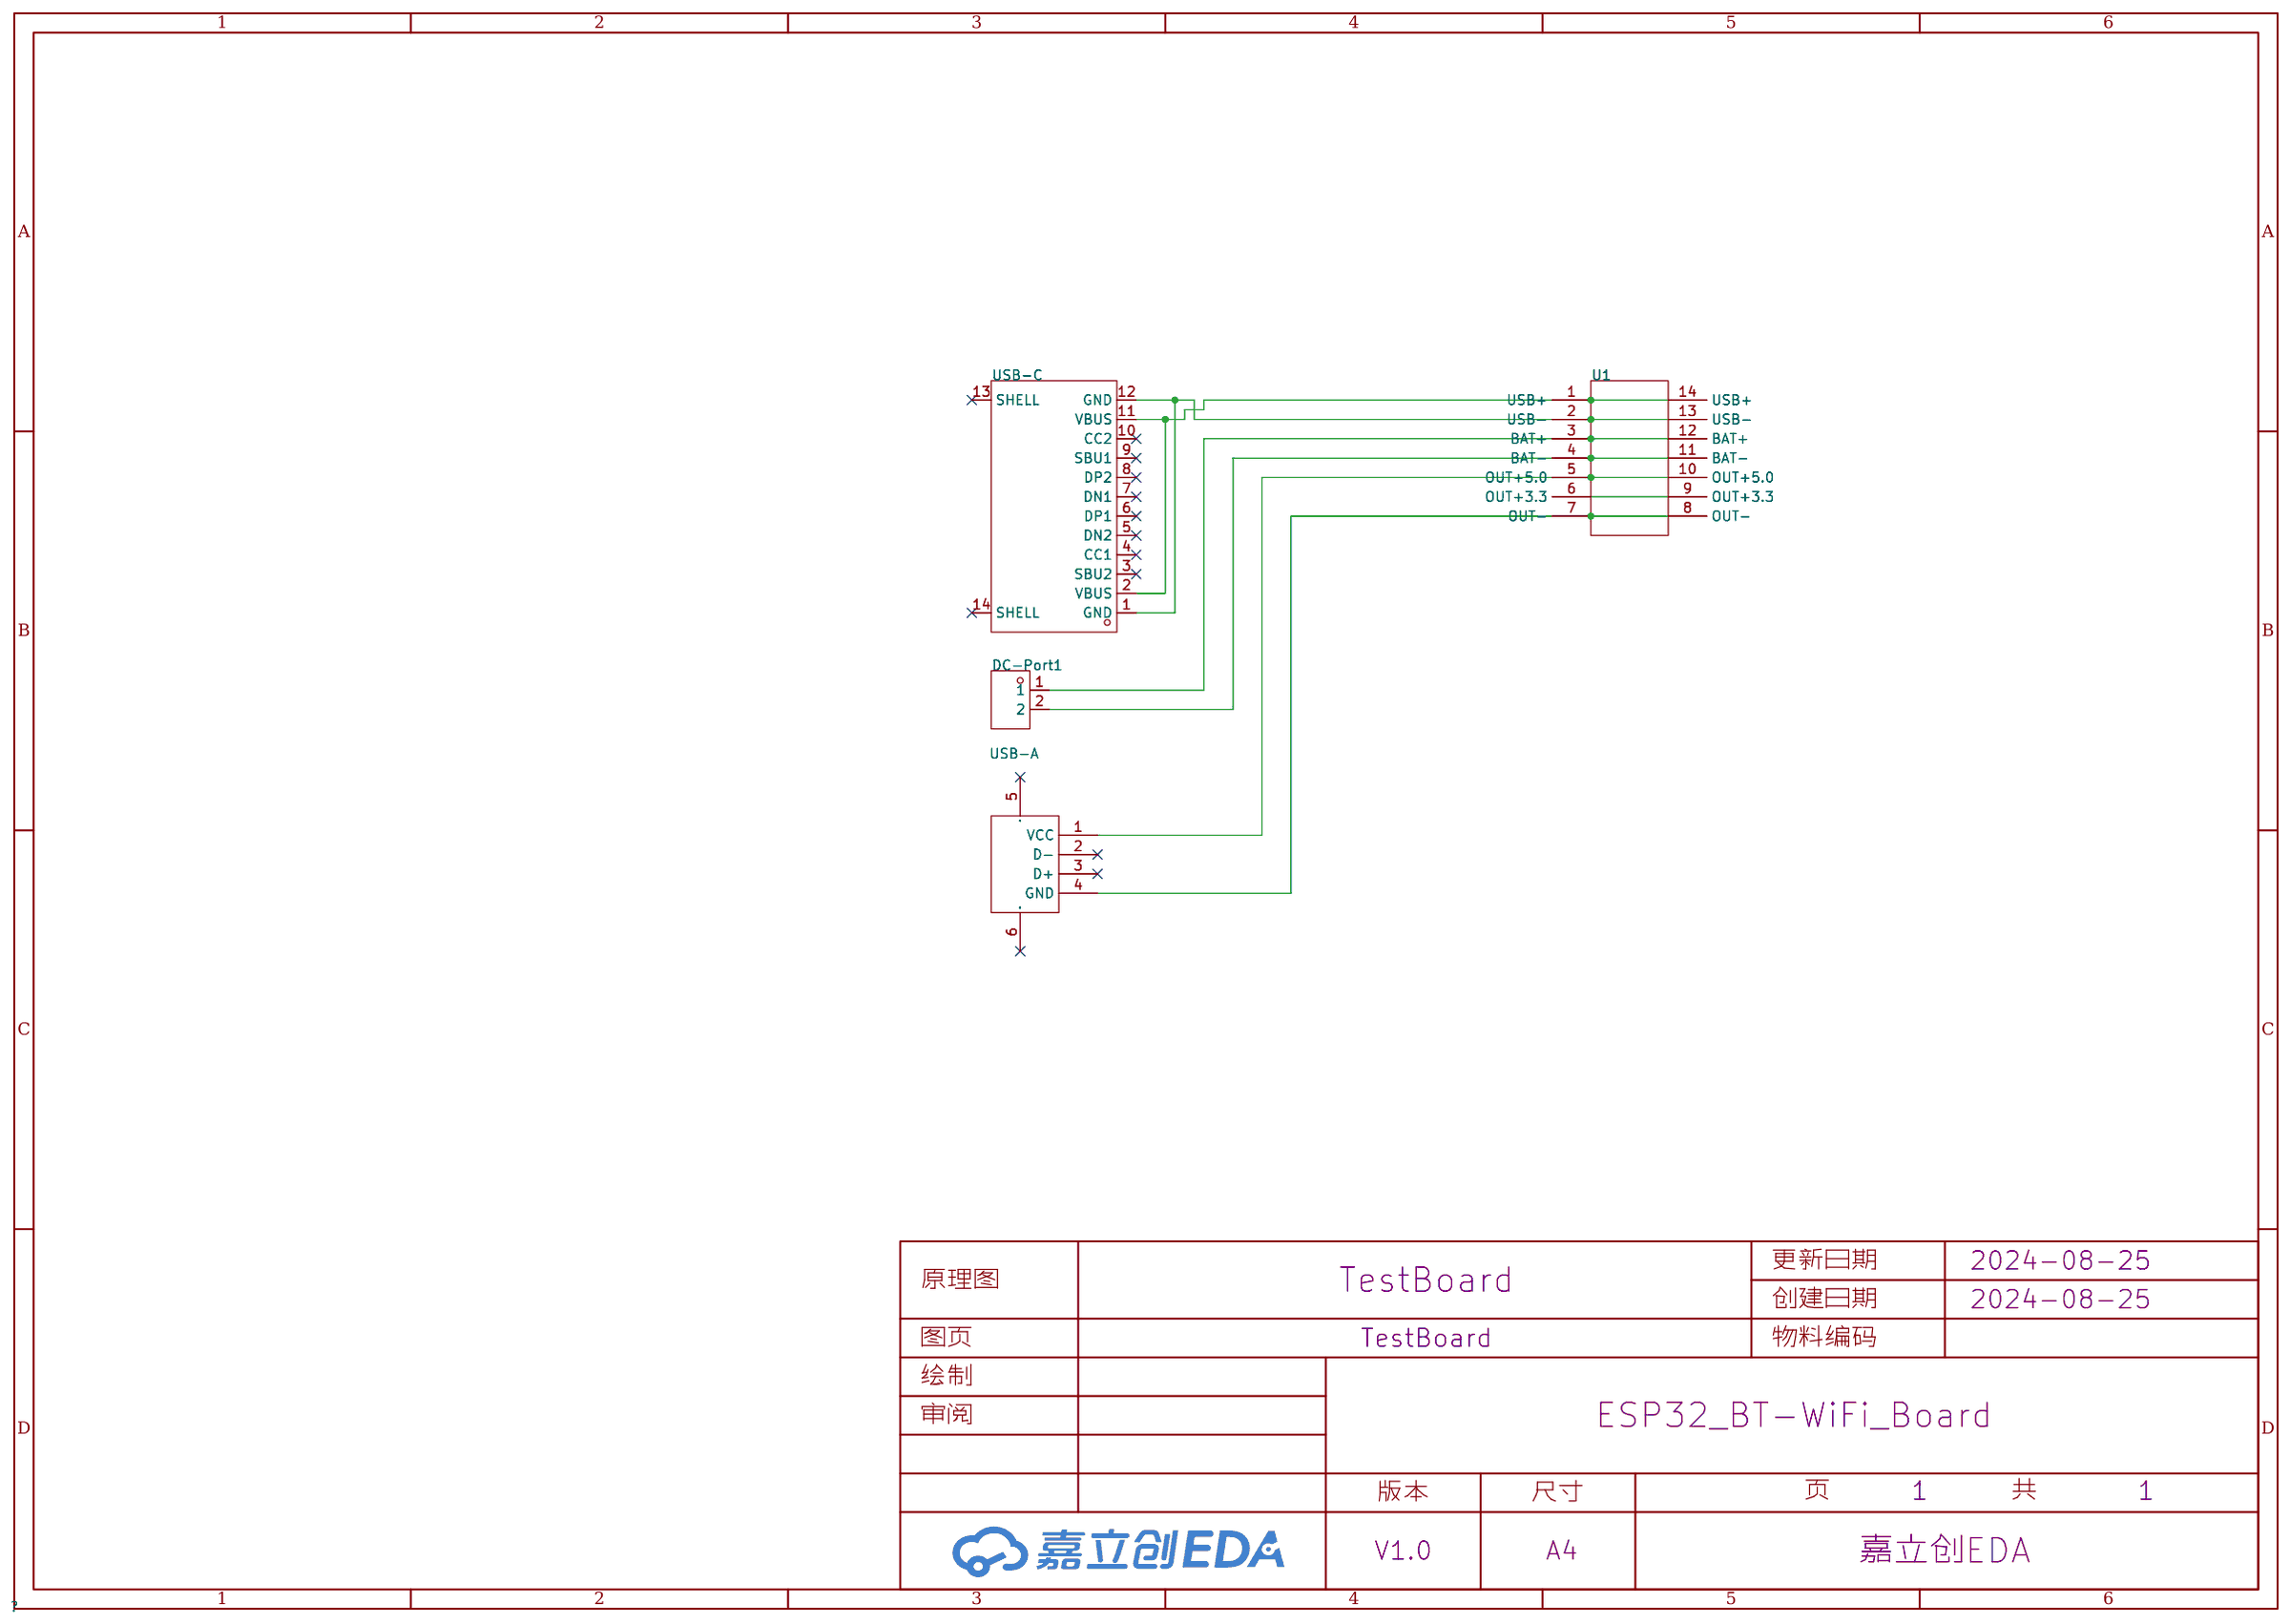
[diagram p5: schematic sheet]

## Parts
DC-Port1  XH-2A  [CONN-TH_2P-P2.50_HCTL_XH-2A-X]
U1  -  [PowerManager]
USB-A  AF180QT1.0  [USB-A-SMD_AF180QT1.0]
USB-C  USB-C  [USB-C-SMD_TYPE-C-6PIN-2MD-073]

## Library data of the parts
DC-Port1 = XH-2A: 插针结构:1x2P;间距:2.5mm;安装方式:直插;参考系列:XH;总PIN数:2P;排数:1;每排PIN数:2;行距:-;额定电流:3A;触头材质:黄铜;触头镀层:锡;工作温度范围:-25℃~+85℃;; LCSC Part Name: 1x2P 间距:2.5mm 直插 系列:XH; Supplier Part: C2908600; Manufacturer: HCTL(华灿天禄); Supplier Footprint: 插件,P=2.5mm; Datasheet: https://atta.szlcsc.com/upload/public/pdf/source/20230711/68D365716984B4AFE576D1D73D61B465.pdf; Supplier: LCSC; Pins Structure: 1x2P; Pitch: 2.5mm; Mounting Style: 直插; Reference Series: XH; Number of Pins: 2P; Number of Rows: 1; Number of PINs Per Row: 2; Current Rating (Max): 3A; Contact Material: 黄铜; Contact Plating: 锡; Operating Temperature Range: -25℃~+85℃
U1 = PowerManagerBoard
USB-A = AF180QT1.0: 连接器类型:Type-A;标准:USB 2.0;公母:母;端口数量:1;触点数量:4P;安装方式:卧贴;额定电流 - 电源:-;工作温度范围:-;; LCSC Part Name: Type-A 母 卧贴; Supplier Part: C404963; Manufacturer: SHOU HAN(首韩); Supplier Footprint: SMD; Datasheet: https://atta.szlcsc.com/upload/public/pdf/source/20190722/C404963_FD7C48D0FD141784D3899E0BE1E5ED69.pdf; Supplier: LCSC; Connector Type: Type-A; Standard: USB 2.0; Gender: 母; Number of Ports: 1; Number of Contacts: 4P; Mounting Style: 卧贴
USB-C = TYPE-C 16PIN 2MD(073): 连接器类型:Type-C;标准:-;公母:母;端口数量:1;触点数量:16P;安装方式:卧贴;额定电流 - 电源:5A;工作温度范围:-25℃~+85℃;; LCSC Part Name: Type-C 母 卧贴; Supplier Part: C2765186; Manufacturer: SHOU HAN(首韩); Supplier Footprint: SMD; Datasheet: https://atta.szlcsc.com/upload/public/pdf/source/20211123/39B17C16241EAC15C5E277BDA434118E.pdf; Supplier: LCSC; Connector Type: Type-C; Gender: 母; Number of Ports: 1; Number of Contacts: 16P; Mounting Style: 卧贴; Current Rating - Power (Max): 5A; Operating Temperature Range: -25℃~+85℃

## Nets
Net-(DC-Port1-1): DC-Port1.1 U1.3(BAT+) U1.12(BAT+)
Net-(DC-Port1-2): DC-Port1.2 U1.4(BAT-) U1.11(BAT-)
Net-(U1-1): U1.1(USB+) U1.14(USB+) USB-C.2(VBUS) USB-C.11(VBUS)
Net-(U1-2): U1.2(USB-) U1.13(USB-) USB-C.1(GND) USB-C.12(GND)
Net-(U1-5): U1.5(OUT+5.0) U1.10(OUT+5.0) USB-A.1(VCC)
Net-(U1-6): U1.6(OUT+3.3) U1.9(OUT+3.3)
Net-(U1-7): U1.7(OUT-) U1.8(OUT-) USB-A.4(GND)

Not connected (* = marked no-connect by the designer): USB-A 2(D-)* 3(D+)* 5(SH1)* 6(SH2)*; USB-C 3(SBU2)* 4(CC1)* 5(DN2)* 6(DP1)* 7(DN1)* 8(DP2)* 9(SBU1)* 10(CC2)* 13(SHELL)* 14(SHELL)*

# Board PCB
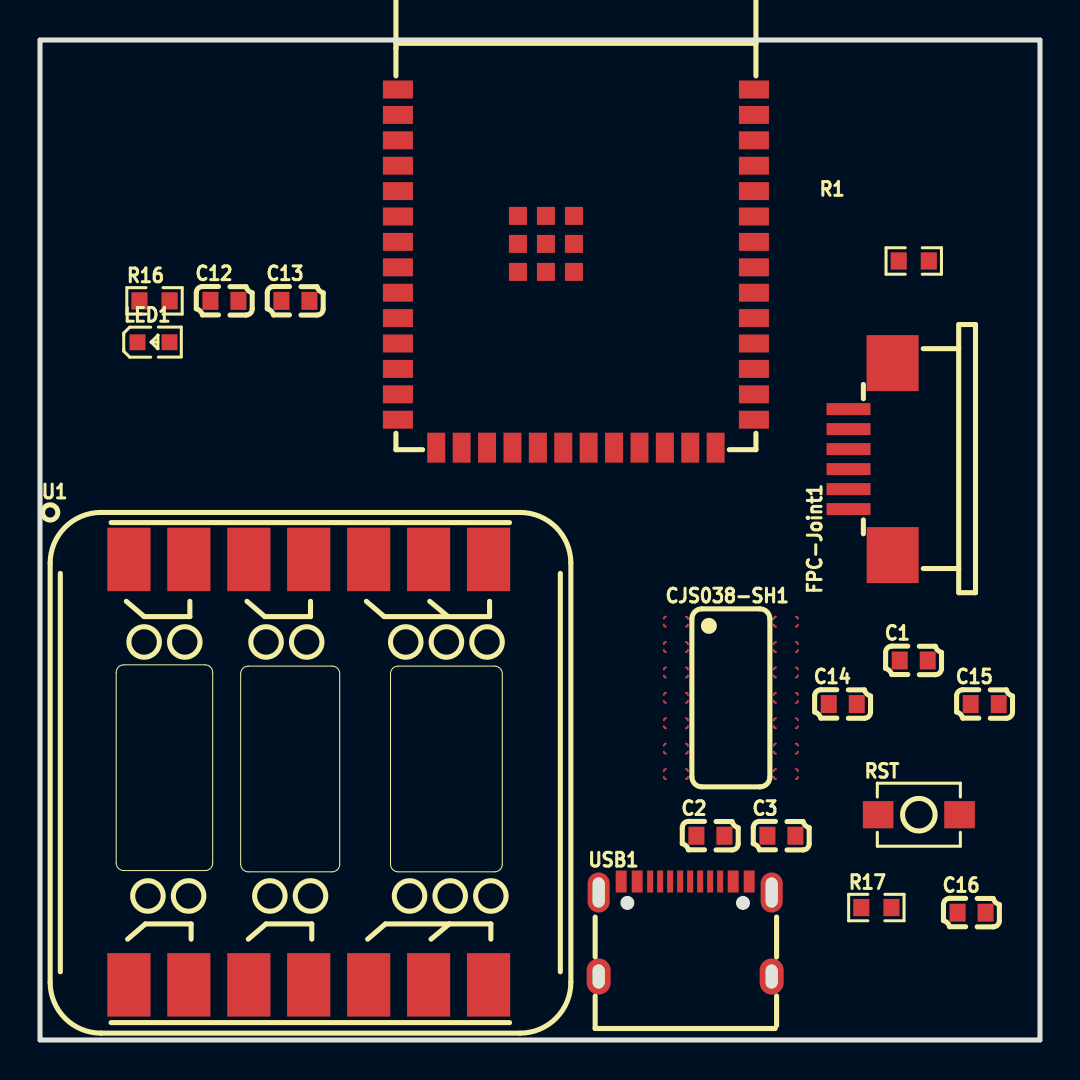
[diagram p6: board, top side]
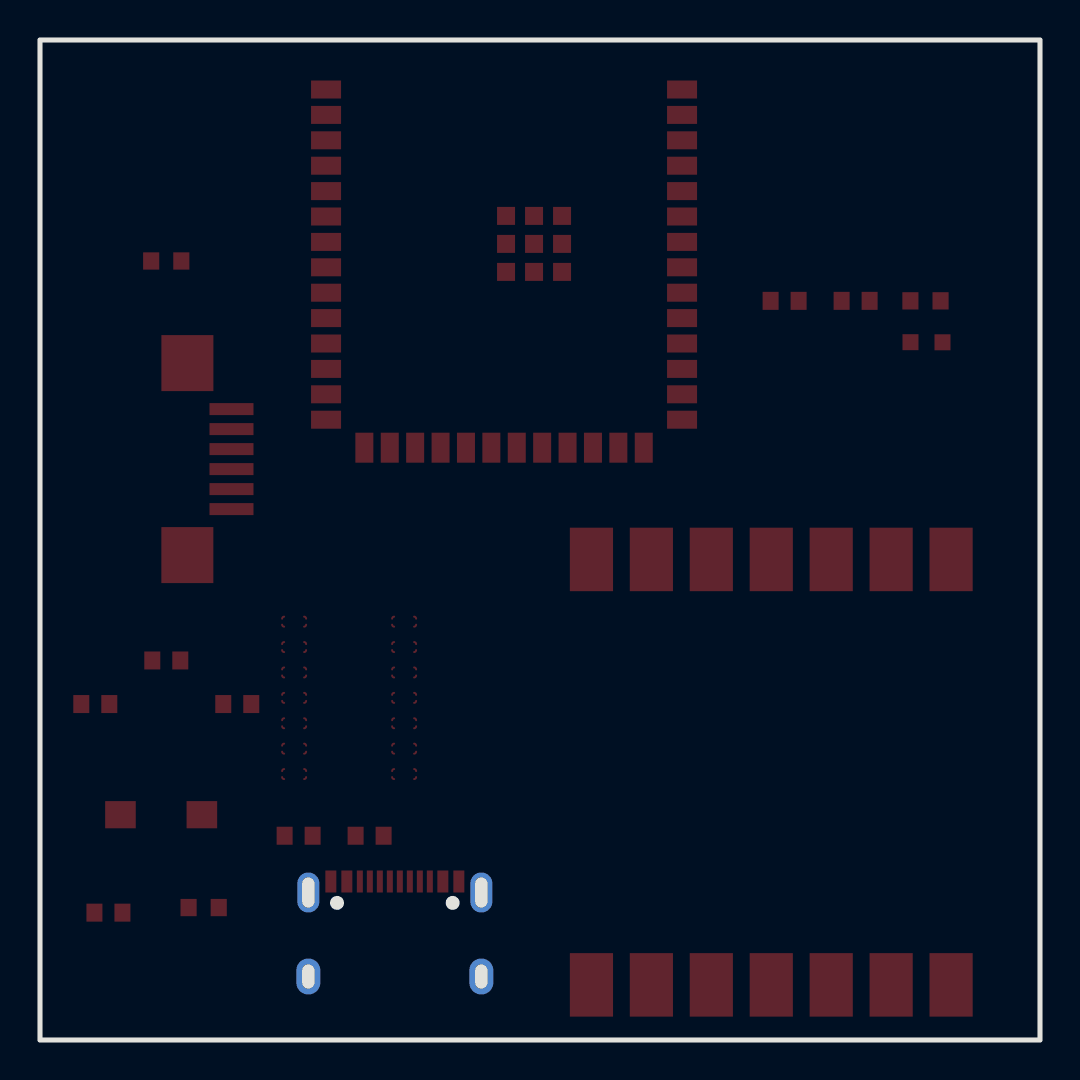
[diagram p7: board, bottom side, seen from below]

Outline 50 x 50 mm; copper layers: Top Layer, Bottom Layer. Coordinates in mm from the lower left corner of the outline.
Outline path: rectangle 0,50 50,0
Stack: Top Layer 0.035mm / Dielectric1 1.51mm FR4 er 4.5 / Bottom Layer 0.035mm

## Design rules (mm)
template: JLCPCB Capability(Two Layers Board)
spacing copperThickness1oz (default): track to track 0.102, other pairs 0.152 to 0.3
spacing copperThickness2oz: track to track 0.203, other pairs 0.152 to 0.3
track width copperThickness1oz (default): min 0.127, default 0.254, max 2.54
track width copperThickness2oz: min 0.203, default 0.254, max 2.54
differential pair differentialPair (default): width min 0.127, default 0.254, max 2.54; gap min 0.152, default 0.152
via viaSize (default): diameter min 0.5, default 0.61, max 10; hole min 0.3, default 0.305, max 6.3

## Placement (name value [footprint] x y rotation side)
C1  -  [C0603]  43.69 18.98 0 top
C2  -  [C0603]  33.52 10.21 0 top
C3  -  [C0603]  37.07 10.21 0 top
C12  -  [C0603]  9.22 36.96 0 top
C13  -  [C0603]  12.77 36.96 0 top
C14  -  [C0603]  40.14 16.8 0 top
C15  -  [C0603]  47.24 16.8 0 top
C16  -  [C0603]  46.58 6.37 0 top
CJS038-SH1  PS/2toUSB  [CJS038-SH]  34.54 17.11 0 top
Core  ESP32-S3-WROOM-1-N4  [WIFIM-SMD_ESP32-S3-WROOM-1-N8]  26.8 38.57 0 top
FPC-Joint1  VCC  [FPC-SMD_C47271]  41.53 29.05 90 top
LED1  -  [LED_0603]  5.73 34.9 0 top
R1  -  [R0603]  43.69 38.95 0 top
R16  -  [R0603]  5.73 36.96 0 top
R17  -  [R0603]  41.82 6.62 0 top
RST  -  [Key_SMD_3x4x2]  43.94 11.27 0 top
U1  -  [PowerManager]  1.02 25.87 0 top
USB1  TYPE-C 16PIN 2MD(073)  [USB-C-SMD_TYPE-C-6PIN-2MD-073]  32.26 5.55 0 top

## Footprints (pads in the part's own frame, mm; a bottom-side part is the same pattern mirrored in y, then rotated)
C0603
  rect 0.8x0.9 smd: 1(-0.7,0) 2(0.7,0)
CJS038-SH
  custom 0x0 smd: 1(-2.75,3.81) 2(-2.75,2.54) 3(-2.75,1.27) 4(-2.75,0) 5(-2.75,-1.27) 6(-2.75,-2.54) 7(-2.75,-3.81) 8(2.75,-3.81) 9(2.75,-2.54) 10(2.75,-1.27) 11(2.75,0) 12(2.75,1.27) 13(2.75,2.54) 14(2.75,3.81)
FPC-SMD_C47271
  rect 0.6x2.2 smd: 1(2.5,1.103) 2(1.5,1.103) 3(0.5,1.103) 4(-0.5,1.103) 5(-1.5,1.103) 6(-2.5,1.103)
  rect 2.8x2.6 smd: 7(-4.8,-1.103) 8(4.8,-1.101)
Key_SMD_3x4x2
  rect 1.53x1.36 smd: 1(-2.035,0) 2(2.035,0)
LED_0603
  rect 0.8x0.8 smd: 1(-0.851,-0.01) 2(0.75,-0.005)
PowerManager
  custom 0x0 smd: 1(3.429,-1.841) 2(6.426,-1.841) 3(9.424,-1.841) 4(12.421,-1.841) 5(15.418,-1.841) 6(18.415,-1.841) 7(21.412,-1.841) 8(21.412,-23.114) 9(18.415,-23.114) 10(15.418,-23.114) 11(12.421,-23.114) 12(9.424,-23.114) 13(6.426,-23.114) 14(3.429,-23.114)
R0603
  rect 0.806x0.864 smd: 1(-0.753,0) 2(0.753,0)
USB-C-SMD_TYPE-C-6PIN-2MD-073
  rect 0.55x1.1 smd: 1(-3.2,2.375) 2(-2.4,2.375) 11(2.4,2.375) 12(3.2,2.375)
  rect 0.3x1.1 smd: 3(-1.75,2.375) 4(-1.25,2.375) 5(-0.75,2.375) 6(-0.25,2.375) 7(0.25,2.375) 8(0.75,2.375) 9(1.25,2.375) 10(1.75,2.375)
  oval 1.1x2 hole 0.6x1.5: 13(-4.325,1.825) 14(4.325,1.825)
  oval 1.2x1.8 hole 0.6x1.2: 13(-4.325,-2.375) 14(4.325,-2.375)
WIFIM-SMD_ESP32-S3-WROOM-1-N8
  rect 1.5x0.9 smd: 1(-8.9,8.954) 2(-8.9,7.684) 3(-8.9,6.415) 4(-8.9,5.144) 5(-8.9,3.874) 6(-8.9,2.604) 7(-8.9,1.335) 8(-8.9,0.065) 9(-8.9,-1.206) 10(-8.9,-2.475) 11(-8.9,-3.745) 12(-8.9,-5.016) 13(-8.9,-6.285) 14(-8.9,-7.556) 27(8.9,-7.556) 28(8.9,-6.285) 29(8.9,-5.016) 30(8.9,-3.745) 31(8.9,-2.475) 32(8.9,-1.206) 33(8.9,0.065) 34(8.9,1.335) 35(8.9,2.604) 36(8.9,3.874) 37(8.9,5.144) 38(8.9,6.415) 39(8.9,7.684) 40(8.9,8.954)
  rect 0.9x1.5 smd: 15(-6.985,-8.954) 16(-5.715,-8.954) 17(-4.445,-8.954) 18(-3.175,-8.954) 19(-1.905,-8.954) 20(-0.635,-8.954) 21(0.635,-8.954) 22(1.905,-8.954) 23(3.175,-8.954) 24(4.445,-8.954) 25(5.715,-8.954) 26(6.985,-8.954)
  rect 0.9x0.9 smd: 41(-2.9,2.635) 41(-2.9,1.235) 41(-2.9,-0.165) 41(-1.5,2.635) 41(-1.5,1.235) 41(-1.5,-0.165) 41(-0.1,2.635) 41(-0.1,1.235) 41(-0.1,-0.165)

## Nets
GND: U1.13 USB1.1 USB1.12
VCC: U1.14 USB1.2 USB1.11
BAT_GND: U1.11
BAT_VCC: U1.12
DN: C14.2 CJS038-SH1.14 Core.20 USB1.5 USB1.7
DP: C15.2 CJS038-SH1.13 Core.19 USB1.6 USB1.8
IO0: Core.27
OUT_5.0V_P: C12.1 CJS038-SH1.11 FPC-Joint1.1 U1.10
PW_3V3: C1.2 C2.2 Core.2 R1.2 R17.1 U1.9
PW_GND: C1.1 C2.1 C3.1 C12.2 C13.2 C14.1 C15.1 C16.2 CJS038-SH1.1 Core.1 Core.40 Core.41 FPC-Joint1.4 LED1.1 RST.2 U1.8
RX: Core.36
TX: Core.37
$1N1725: C3.2 C16.1 Core.3 R1.1 R17.2 RST.1
$3N416: CJS038-SH1.10 FPC-Joint1.5
$3N417: CJS038-SH1.9 FPC-Joint1.3
$3N419: CJS038-SH1.4 R16.2
$3N420: LED1.2 R16.1
$3N421: C13.1 CJS038-SH1.12

Pads without a net: CJS038-SH1 2 3 5 6 7 8; Core 4 5 6 7 8 9 10 11 12 13 14 15 16 17 18 21 22 23 24 25 26 28 29 30 31 32 33 34 35 38 39; FPC-Joint1 2 6 7 8; U1 1 2 3 4 5 6 7; USB1 3 4 9 10 13 14

# Board PCB2
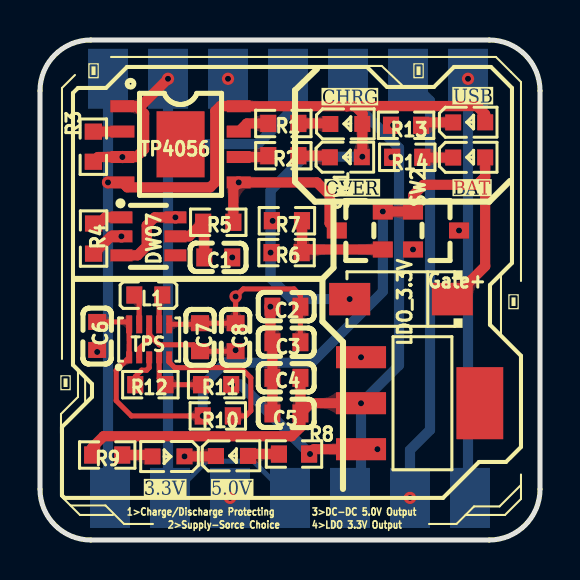
[diagram p8: board, top side]
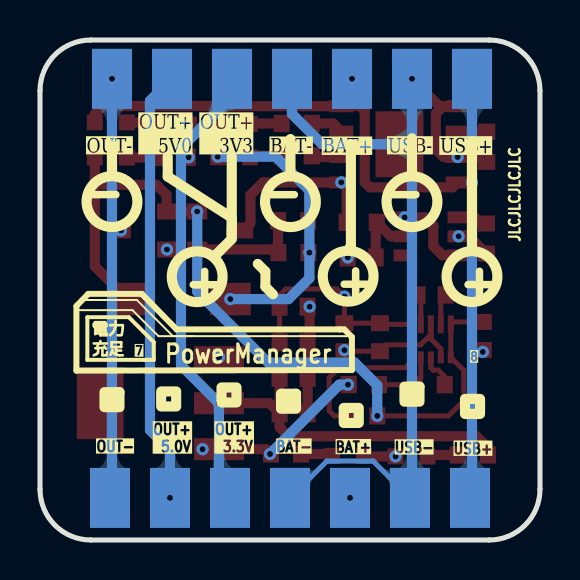
[diagram p9: board, bottom side, seen from below]

Outline 25 x 25 mm; copper layers: Top Layer, Inner1, Inner2, Bottom Layer. Coordinates in mm from the lower left corner of the outline.
Outline path: 0,22.46 0,2.54 arc(0.74,0.74) 2.54,0 22.46,0 arc(24.26,0.74) 25,2.54 25,22.46 arc(24.26,24.26) 22.46,25 2.54,25 arc(0.74,24.26) 0,22.46
Stack: Top Layer 0.035mm / Dielectric1 1.51mm FR4 er 4.5 / Inner1 0.035mm / Dielectric2 0.48mm PP er 4.5 / Inner2 0.035mm / Dielectric3 0.48mm PP er 4.5 / Bottom Layer 0.035mm

## Design rules (mm)
template: JLCPCB Capability(Two Layers Board)
spacing copperThickness1oz (default): track to track 0.102, other pairs 0.152 to 0.3
spacing copperThickness2oz: track to track 0.203, other pairs 0.152 to 0.3
track width copperThickness1oz (default): min 0.127, default 0.254, max 2.54
track width copperThickness2oz: min 0.203, default 0.254, max 2.54
differential pair differentialPair (default): width min 0.127, default 0.254, max 2.54; gap min 0.152, default 0.152
via viaSize (default): diameter min 0.5, default 0.61, max 10; hole min 0.3, default 0.305, max 6.3

## Placement (name value [footprint] x y rotation side)
3.3V  -  [LED0603-RD_WHITE]  6.43 4.18 180 top
5.0V  -  [LED0603-RD_WHITE]  9.6 4.2 0 top
BAT  -  [LED0603-RD_BLUE]  21.46 19.13 0 top
C1  0.1uF  [C0603]  8.91 14.13 0 top
C2  104  [C0603]  12.32 11.67 0 top
C3  10uF  [C0603]  12.32 9.89 0 top
C4  104  [C0603]  12.32 8.11 0 top
C5  10uF  [C0603]  12.32 6.33 0 top
C6  10uF  [C0603]  2.86 10.2 90 top
C7  22uF  [C0603]  8 10.14 90 top
C8  22uF  [C0603]  9.78 10.14 90 top
CHRG  -  [LED_0603]  15.37 20.81 0 top
DW07  -  [SOT-23-6_L2.9-W1.6-P0.95-LS2.8-BR]  5.42 15.18 180 top
Gate+  -  [SMA_1N4007]  18.05 12.05 180 top
L1  0.47uH  [L0603]  5.42 12.25 180 top
LDO_3.3V  -  [SOT-223-3_L6.5-W3.4-P2.30-LS7.0-BR]  19.02 6.84 180 top
NOREF  -  [Pad_e1054]  15.4 23.06 0 top
NOREF#2  -  [Pad_e1053]  12.4 23.06 0 top
NOREF#3  -  [Pad_e1060]  12.5 2.11 0 top
NOREF#4  -  [Pad_e1058]  6.5 2.11 0 top
NOREF#5  -  [Pad_e1057]  3.5 2.11 0 top
NOREF#6  -  [Pad_e1056]  21.4 23.06 0 top
NOREF#7  -  [Pad_e1059]  9.5 2.11 0 top
NOREF#8  -  [Pad_e1050]  3.4 23.06 0 top
NOREF#9  -  [Pad_e1062]  18.5 2.11 0 top
NOREF#10  -  [Pad_e1055]  18.4 23.06 0 top
NOREF#11  -  [Pad_e1061]  15.5 2.11 0 top
NOREF#12  -  [Pad_e1063]  21.5 2.11 0 top
NOREF#13  -  [Pad_e1051]  6.4 23.06 0 top
NOREF#14  -  [Pad_e1052]  9.4 23.06 0 top
OVER  -  [LED0603-RD_GREEN]  15.29 19.14 0 top
R1  1K  [R0603]  12.17 20.83 0 top
R2  10K  [R0603]  12.17 19.21 0 top
R3  1.2K  [R0603]  2.67 19.67 90 top
R4  1K  [R0603]  2.68 15.07 90 top
R5  100  [R0603]  8.91 15.89 180 top
R6  100  [R0603]  12.33 14.37 0 top
R7  10K  [R0603]  12.35 15.96 180 top
R8  10K  [R0603]  12.7 4.3 180 top
R9  10K  [R0603]  3.36 4.25 0 top
R10  100K  [R0603]  8.89 6.2 0 top
R11  780K  [R0603]  8.81 7.77 0 top
R12  100K  [R0603]  5.52 7.77 0 top
R13  10K  [R0603]  18.3 20.74 180 top
R14  10K  [R0603]  18.36 19.13 180 top
SW1  AO3401A  [SOT-23_L2.9-W1.3-P1.90-LS2.4-BR]  15.99 15.48 0 top
SW2  AO3401A  [SOT-23_L2.9-W1.3-P1.90-LS2.4-BR]  19.8 15.48 180 top
TP4056  TP4056  [ESOP-8_L4.9-W3.9-P1.27-LS6.0-BL-EP]  7.03 19.78 270 top
TPS  -  [VSON-10_L3.0-W2.0-P0.50-TL]  5.46 9.96 90 top
USB  -  [LED0603-RD_BLUE]  21.46 20.88 0 top

## Footprints (pads in the part's own frame, mm; a bottom-side part is the same pattern mirrored in y, then rotated)
C0603
  rect 0.8x0.9 smd: 1(-0.7,0) 2(0.7,0)
ESOP-8_L4.9-W3.9-P1.27-LS6.0-BL-EP
  rect 0.6x1.2 smd: 1(-1.905,-2.909) 2(-0.635,-2.909) 3(0.635,-2.909) 4(1.905,-2.909) 5(1.905,2.909) 6(0.635,2.909) 7(-0.635,2.909) 8(-1.905,2.909)
  rect 3.3x2.4 smd: 9(0,0)
L0603
  rect 0.8x0.864 smd: 1(-0.7,0) 2(0.7,0)
LED0603-RD_BLUE
  rect 0.8x0.8 smd: 1(-0.799,-0.004) 2(0.799,0.004)
LED0603-RD_GREEN
  rect 0.8x0.8 smd: 1(-0.799,-0.004) 2(0.799,0.004)
LED0603-RD_WHITE
  rect 0.8x0.8 smd: 1(-0.799,-0.004) 2(0.799,0.004)
LED_0603
  rect 0.8x0.8 smd: 1(-0.851,-0.01) 2(0.75,-0.005)
Pad_e1050
  custom 0x0 smd far side: USB(0,0)
Pad_e1051
  custom 0x0 smd far side: USB(0,0)
Pad_e1052
  custom 0x0 smd far side: BAT(0,0)
Pad_e1053
  custom 0x0 smd far side: BAT(0,0)
Pad_e1054
  custom 0x0 smd far side: USB(0,0)
Pad_e1055
  custom 0x0 smd far side: USB(0,0)
Pad_e1056
  custom 0x0 smd far side: OUTN(0,0)
Pad_e1057
  custom 0x0 smd far side: USB(0,0)
Pad_e1058
  custom 0x0 smd far side: USB(0,0)
Pad_e1059
  custom 0x0 smd far side: BAT(0,0)
Pad_e1060
  custom 0x0 smd far side: BAT(0,0)
Pad_e1061
  custom 0x0 smd far side: USB(0,0)
Pad_e1062
  custom 0x0 smd far side: USB(0,0)
Pad_e1063
  custom 0x0 smd far side: OUTN(0,0)
R0603
  rect 0.806x0.864 smd: 1(-0.753,0) 2(0.753,0)
SMA_1N4007
  rect 2.046x1.62 smd: 1(-2.566,0) 2(2.566,0)
SOT-23-6_L2.9-W1.6-P0.95-LS2.8-BR
  rect 1.1x0.6 smd: 1(1.35,-0.95) 2(1.35,0) 3(1.35,0.95) 4(-1.35,0.95) 5(-1.35,0) 6(-1.35,-0.95)
SOT-23_L2.9-W1.3-P1.90-LS2.4-BR
  rect 1x0.8 smd: 1(1.15,-0.95) 2(1.15,0.95) 3(-1.15,0)
SOT-223-3_L6.5-W3.4-P2.30-LS7.0-BR
  rect 2.5x1.1 smd: 1(2.97,-2.3) 2(2.97,0) 3(2.97,2.3)
  rect 2.34x3.6 smd: 4(-2.97,0)
VSON-10_L3.0-W2.0-P0.50-TL
  rect 0.6x0.3 smd: 1(-0.825,1) 2(-0.825,0.5) 3(-0.825,0) 4(-0.825,-0.5) 5(-0.825,-1)
  rect 0.9x0.3 smd: 6(0.825,-1) 7(0.825,-0.5) 9(0.825,0.5) 10(0.825,1)
  rect 1.3x0.3 smd: 8(0.625,0)

## Nets
AGND: R12.1 TPS.3
DGND: 3.3V.1 5.0V.1 C1.2 C2.1 C3.1 C4.1 C5.1 C6.1 C7.1 C8.1 DW07.3 DW07.6 LDO_3.3V.1 NOREF#6.OUTN NOREF#12.OUTN R14.2 SW2.3 TPS.2 TPS.8
GND: DW07.2 NOREF#2.BAT NOREF#3.BAT NOREF#4.USB NOREF#13.USB R3.1 R4.1 R7.2 R13.2 SW2.2 TP4056.1 TP4056.3
VCC: CHRG.2 Gate+.2 NOREF#5.USB NOREF#8.USB OVER.2 R6.1 TP4056.4 TP4056.8 USB.2
BAT_P_I: NOREF#7.BAT NOREF#14.BAT R5.1 SW1.3 TP4056.5
OUT_3.3V_P: C4.2 C5.2 LDO_3.3V.2 NOREF.USB NOREF#11.USB R9.1
OUT_5.0V_P: C2.2 C3.2 C7.2 C8.2 LDO_3.3V.3 NOREF#9.USB NOREF#10.USB R8.1 R11.2 TPS.6
PW_P: BAT.2 C6.2 Gate+.1 R10.1 SW1.2 SW2.1 TPS.1 TPS.10
$1N753: R3.2 TP4056.2
$1N897: OVER.1 R2.2
$1N964: CHRG.1 R1.2
$1N968: R1.1 TP4056.7
$1N975: R2.1 TP4056.6
$1N1874: R6.2 R7.1 SW1.1
$1N7526: 5.0V.2 R8.2
$1N7553: 3.3V.2 R9.2
$1N8307: DW07.1 R4.2
$1N8437: C1.1 DW07.5 R5.2
$1N9793: L1.2 TPS.9
$1N9797: L1.1 TPS.7
$1N10563: R10.2 TPS.5
$1N11159: R11.1 R12.2 TPS.4
$1N18992: R13.1 USB.1
$1N19087: BAT.1 R14.1

Pads without a net: DW07 4; LDO_3.3V 4; TP4056 9

## Via types
v1: diameter 0.61, hole 0.305, Top Layer to Bottom Layer, 31 vias

## Routing (per net, layer and track width the routed paths; a pad name or vN(x,y) marks a point on that pad's centre or on a via; arc(x,y) is an arc through that point)
AGND: length 1.8
  Top Layer w0.254: R12.1 4.76,8.17 5.08,8.49 5.33,8.49 5.46,8.61 TPS.3
DGND: length 85.2
  Top Layer w0.254: C8.1 C7.1 7.68,9.76 5.97,9.76 5.46,10.27 ; 5.46,10.27 TPS.8 ; 5.46,10.27 5.46,10.06 4.96,9.56 TPS.2
  Top Layer w0.508: C5.1 C4.1 C3.1 11.52,9.99 v1(11.52,11.67) ; DW07.3 4.87,14.23 5.33,14.69 5.33,15.73 5.74,16.13 v1(6.77,16.13) ; v1(7.22,4.18) 8.73,4.18 8.78,4.23
  Inner2 w0.508: v1(11.52,11.67) 13.53,11.67 v1(16.05,9.14) 20.95,14.04 v1(20.95,15.48) 20.95,15.75 v1(17.57,19.13) 21.4,22.97 v1(21.4,23.06) ; v1(11.52,11.67) 9.34,9.49 ; v1(11.52,11.67) 11.43,11.75 11.43,13.19 10.49,14.13 v1(9.61,14.13) 8.77,14.13 v1(6.77,16.13) ; 7.22,7.37 9.34,9.49 ; 7.22,7.37 v1(7.22,4.18) ; 7.22,7.37 7.2,7.35 4.92,7.35 v1(2.86,9.4) ; 9.34,9.49 v1(9.78,9.49)
  Bottom Layer w0.508: NOREF#12.OUTN 21.4,2.21 v1(21.4,23.06)
GND: length 79
  Top Layer w0.508: v1(6.4,23.06) 5.03,21.69 4.84,21.69 ; R3.1 2.9,19.15 v1(4.12,19.15) 4.82,19.15 5.21,19.54 5.21,21.32 4.84,21.69 ; 4.84,21.69 TP4056.1 ; v1(4.07,15.18) 3.54,15.18 R4.1
  Inner1 w0.508: 18.65,14.59 13,14.59 v1(11.63,15.96) ; 18.65,14.59 v1(18.65,14.53) ; 18.65,14.59 18.65,19.74 v1(17.65,20.74) 5.71,20.74 v1(4.12,19.15) 4.12,15.23 v1(4.07,15.18)
  Bottom Layer w0.25: NOREF#3.BAT 10.66,3.95 8.34,3.95 NOREF#4.USB
  Bottom Layer w0.508: 6.4,19.79 6.4,2.21 NOREF#4.USB ; 6.4,19.79 10.89,19.79 12.4,21.31 NOREF#2.BAT ; 6.4,19.79 v1(6.4,23.06)
VCC: length 61.5
  Top Layer w0.508: USB.2 22.26,21.28 21.84,21.7 15.34,21.7 15.33,21.69 ; 15.33,21.69 TP4056.8 9.93,21.7 9.02,21.7 8.76,21.44 8.76,17.89 8.51,17.63 4.36,17.63 TP4056.4 v1(3.4,17.88) ; 15.33,21.69 15.76,21.69 16.13,21.32 16.13,20.82 CHRG.2 v1(16.12,19.16) OVER.2
  Bottom Layer w0.508: NOREF#5.USB 3.4,2.21 v1(3.4,17.88) NOREF#8.USB ; v1(16.12,19.16) 13.21,19.16 11.53,17.48 v1(11.53,14.37) 11.53,13.09 12.57,12.05 v1(15.48,12.05)
BAT_P_I: length 40.9
  Top Layer w0.508: SW1.3 14.48,15.84 14.48,17.25 13.85,17.88 v1(9.94,17.88) 9.67,17.61 R5.1
  Inner2 w0.508: v1(9.4,23.06) 9.94,22.52 v1(9.94,17.88) 9.91,17.9 6.2,17.9 1.65,13.35 1.65,6.5 6.04,2.11 v1(9.5,2.11)
OUT_3.3V_P: length 39.9
  Top Layer w0.508: C5.2 13.53,6.84 v1(16.05,6.84) ; C5.2 C4.2 ; C5.2 13.02,5.63 12.57,5.19 3.18,5.19 2.61,4.62 R9.1
  Bottom Layer w0.25: NOREF#11.USB 16.05,2.66
  Bottom Layer w0.508: 16.05,2.66 v1(16.05,6.84) 17.95,8.74 17.95,19.6 15.4,22.15 NOREF.USB
OUT_5.0V_P: length 49.7
  Top Layer w0.254: C3.2 C2.2 13.02,12.23 12.7,12.55 10.16,12.55 v1(9.78,12.17) C8.2 C7.2 7.94,10.78 6.46,10.78
  Top Layer w0.508: v1(16.87,4.54) 13.69,4.54 R8.1
  Inner1 w0.508: v1(9.6,7.77) 9.23,7.77 8.76,8.24 8.76,11.16 v1(9.78,12.17)
  Inner2 w0.508: v1(18.5,2.11) 18.5,2.91 v1(16.87,4.54)
  Bottom Layer w0.508: v1(18.5,2.11) 18.5,4.5 19.5,5.5 19.5,21.96 NOREF#10.USB ; v1(9.6,7.77) 10.03,7.77 v1(13.5,4.3)
PW_P: length 40.9
  Top Layer w0.254: v1(8.14,6.2) 4.57,6.2 3.81,6.97 3.81,8.48 TPS.1 4.46,10.78 4.34,10.9 C6.2
  Top Layer w0.508: v1(17.14,16.43) SW2.1 18.67,16.44 18.67,17.25 19.18,17.76 21.84,17.76 22.26,18.18 ; Gate+.1 22.26,13.69 22.26,18.18 ; 22.26,18.18 BAT.2
  Bottom Layer w0.508: v1(8.14,6.2) 8.14,7.74 9.27,8.87 13.59,8.87 17.14,12.42 v1(17.14,16.43)
$1N753: length 1.5
  Top Layer w0.508: R3.2 TP4056.2
$1N897: length 1.6
  Top Layer w0.508: R2.2 14.41,19.21 OVER.1
$1N964: length 1.6
  Top Layer w0.508: R1.2 14.49,20.83 CHRG.1
$1N968: length 1.6
  Top Layer w0.508: R1.1 10.34,20.83 TP4056.7
$1N975: length 1.5
  Top Layer w0.508: R2.1 11.35,19.15 TP4056.6
$1N1874: length 5.7
  Top Layer w0.508: SW1.1 13.24,14.53 13.1,14.39 ; 13.1,14.39 R6.2 ; 13.1,14.39 R7.1
$1N7526: length 1.6
  Top Layer w0.508: 10.38,4.23 10.44,4.3 R8.2
$1N7553: length 1.5
  Top Layer w0.508: 3.3V.2 5.55,4.25 R9.2
$1N8307: length 1.5
  Top Layer w0.508: DW07.1 3.27,16.13 2.96,15.83 R4.2
$1N8437: length 3.5
  Top Layer w0.508: DW07.5 7.46,15.18 R5.2 8.21,15.83 C1.1
$1N9793: length 1.6
  Top Layer w0.254: 4.96,10.78 4.96,12.01 L1.2
$1N9797: length 1.5
  Top Layer w0.254: 5.96,10.78 5.96,12.09 L1.1
$1N10563: length 7.3
  Top Layer w0.254: TPS.5 6.46,8.89 6.73,8.62 10.03,8.62 10.54,8.11 10.54,6.46 10.29,6.2 R10.2
$1N11159: length 3.3
  Top Layer w0.254: TPS.4 5.96,8.08 R12.2 R11.1
$1N18992: length 1.7
  Top Layer w0.508: USB.1 19.2,20.88 R13.1
$1N19087: length 1.5
  Top Layer w0.508: BAT.1 19.12,19.12 R14.1

## Copper pours and planes (outline as drawn; the poured copper is in the pictures)
DGND on Top Layer: -2.86,25.94 27.37,25.94 27.37,-1.62 -2.86,-1.62
DGND on Inner2: -11.11,34.17 36.14,34.17 36.14,-8.89 -11.11,-8.89
GND on Inner1: -7.83,30.99 32.04,30.99 32.04,-4.06 -7.83,-4.06
VCC on Bottom Layer: -5.4,-10.58 -5.4,35.39 30.41,35.39 30.41,-10.58
OUT_5.0V_P on Bottom Layer: 9.6,7.82 13.5,7.82 13.5,4.35 9.6,4.35
PW_P on Bottom Layer: 8.04,17.44 18.55,17.44 18.55,6.25 8.04,6.25

Small or netless copper shapes (teardrops, artwork), in the pictures only: 93 on Top Layer, 14 on Bottom Layer, 3 on Inner1, 6 on Inner2

## Text on the board
Bottom Silkscreen Layer: 8 | 7 | USB+ | USB- | BAT+ | BAT- | OUT+ / 3.3V | OUT+ / 5.0V | OUT- | JLCJLCJLCJLC | PowerManager | - | + | 電力 / 充足 | OUT+ / 3V3 | OUT+ / 5V0
Top Silkscreen Layer: 1>Charge/Discharge Protecting | 2>Supply-Sorce Choice | 3>DC-DC 5.0V Output | 4>LDO 3.3V Output | ③ | ① | ② | ④

# Board PCB3
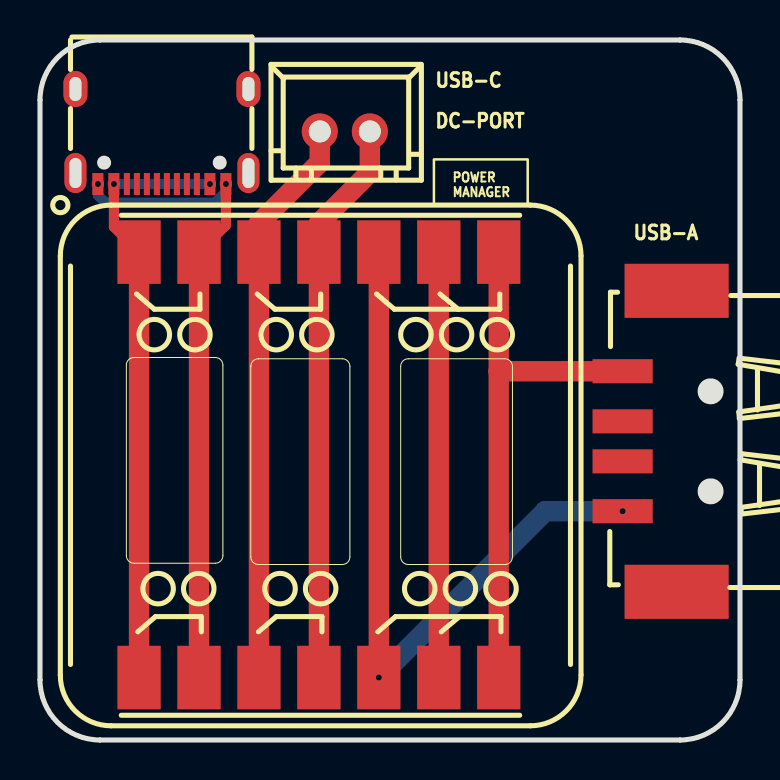
[diagram p10: board, top side]
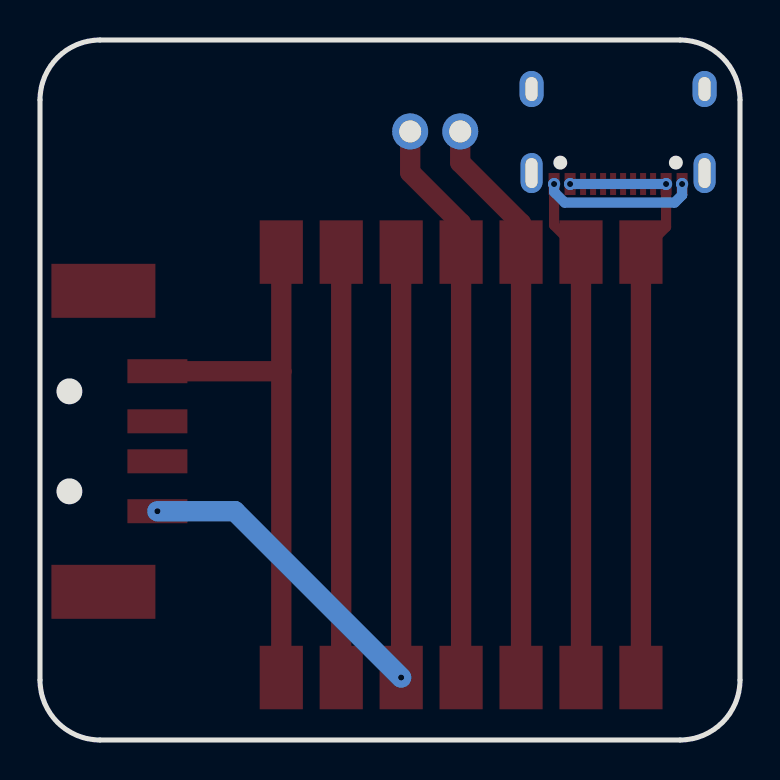
[diagram p11: board, bottom side, seen from below]

Outline 35 x 35 mm; copper layers: Top Layer, Bottom Layer. Coordinates in mm from the lower left corner of the outline.
Outline path: 0,32 0,3 arc(0.88,0.88) 3,0 32,0 arc(34.12,0.88) 35,3 35,32 arc(34.12,34.12) 32,35 3,35 arc(0.88,34.12) 0,32
Stack: Top Layer 0.035mm / Dielectric1 1.51mm FR4 er 4.5 / Bottom Layer 0.035mm

## Design rules (mm)
template: JLCPCB Capability(Two Layers Board)
spacing copperThickness1oz (default): track to track 0.102, other pairs 0.152 to 0.3
spacing copperThickness2oz: track to track 0.203, other pairs 0.152 to 0.3
track width copperThickness1oz (default): min 0.127, default 0.254, max 2.54
track width copperThickness2oz: min 0.203, default 0.254, max 2.54
differential pair differentialPair (default): width min 0.127, default 0.254, max 2.54; gap min 0.152, default 0.152
via viaSize (default): diameter min 0.5, default 0.61, max 10; hole min 0.3, default 0.305, max 6.3

## Placement (name value [footprint] x y rotation side)
DC-PORT  -  [CONN-TH_2P-P2.50_HCTL_XH-2A-X]  15.24 30.43 0 top
POWER
MANAGER  -  [PowerManager]  1.52 26.24 0 top
USB-A  AF180QT1.0  [USB-A-SMD_AF180QT1.0]  30.48 14.93 90 top
USB-C  USB-C  [USB-C-SMD_TYPE-C-6PIN-2MD-073]  6.1 30.17 180 top

## Footprints (pads in the part's own frame, mm; a bottom-side part is the same pattern mirrored in y, then rotated)
CONN-TH_2P-P2.50_HCTL_XH-2A-X
  round 1.8 hole 1.1: 1(-1.251,0) 2(1.251,0)
PowerManager
  custom 0x0 smd: 1(3.429,-1.841) 2(6.426,-1.841) 3(9.424,-1.841) 4(12.421,-1.841) 5(15.418,-1.841) 6(18.415,-1.841) 7(21.412,-1.841) 8(21.412,-23.114) 9(18.415,-23.114) 10(15.418,-23.114) 11(12.421,-23.114) 12(9.424,-23.114) 13(6.426,-23.114) 14(3.429,-23.114)
USB-A-SMD_AF180QT1.0
  rect 1.2x3 smd: 1(-3.495,1.35) 2(-1,1.35) 3(1,1.35) 4(3.505,1.35)
  rect 2.7x5.2 smd: 5(7.525,-1.35) 6(-7.525,-1.35)
USB-C-SMD_TYPE-C-6PIN-2MD-073
  rect 0.55x1.1 smd: 1(-3.2,2.375) 2(-2.4,2.375) 11(2.4,2.375) 12(3.2,2.375)
  rect 0.3x1.1 smd: 3(-1.75,2.375) 4(-1.25,2.375) 5(-0.75,2.375) 6(-0.25,2.375) 7(0.25,2.375) 8(0.75,2.375) 9(1.25,2.375) 10(1.75,2.375)
  oval 1.1x2 hole 0.6x1.5: 13(-4.325,1.825) 14(4.325,1.825)
  oval 1.2x1.8 hole 0.6x1.2: 13(-4.325,-2.375) 14(4.325,-2.375)

## Nets
$1N466: POWER
MANAGER.1 POWER
MANAGER.14 USB-C.2 USB-C.11
$1N477: POWER
MANAGER.2 POWER
MANAGER.13 USB-C.1 USB-C.12
$1N486: DC-PORT.1 POWER
MANAGER.3 POWER
MANAGER.12
$1N492: DC-PORT.2 POWER
MANAGER.4 POWER
MANAGER.11
$1N498: POWER
MANAGER.5 POWER
MANAGER.10 USB-A.1
$1N504: POWER
MANAGER.6 POWER
MANAGER.9
$1N507: POWER
MANAGER.7 POWER
MANAGER.8 USB-A.4

Pads without a net: USB-A 2 3 5 6; USB-C 3 4 5 6 7 8 9 10 13 14

## Via types
v1: diameter 0.61, hole 0.305, Top Layer to Bottom Layer, 6 vias

## Routing (per net, layer and track width the routed paths; a pad name or vN(x,y) marks a point on that pad's centre or on a via; arc(x,y) is an arc through that point)
$1N466: length 30
  Top Layer w0.508: POWER
MANAGER.1 3.7,25.65 v1(3.7,27.8)
  Top Layer w1.016: POWER
MANAGER.1 POWER
MANAGER.14
  Bottom Layer w0.508: v1(3.7,27.8) v1(8.5,27.8)
$1N477: length 33
  Top Layer w0.508: v1(9.3,27.8) 9.3,25.74 POWER
MANAGER.2
  Top Layer w1.016: POWER
MANAGER.2 POWER
MANAGER.13
  Bottom Layer w0.508: v1(2.9,27.8) 2.9,27.24 3.26,26.87 8.76,26.87 9.3,27.41 v1(9.3,27.8)
$1N486: length 28.6
  Top Layer w1.016: DC-PORT.1 13.99,28.87 10.95,25.83 POWER
MANAGER.3 POWER
MANAGER.12
$1N492: length 28.4
  Top Layer w1.016: POWER
MANAGER.11 POWER
MANAGER.4 13.95,24.4 13.95,25.84 16.49,28.38 DC-PORT.2
$1N498: length 36.9
  Top Layer w1.016: POWER
MANAGER.5 v1(16.94,3.12)
  Bottom Layer w1.016: v1(29.13,11.44) 25.26,11.44 v1(16.94,3.12)
$1N504: length 21.3
  Top Layer w1.016: 19.94,24.4 19.94,3.12
$1N507: length 27.5
  Top Layer w1.016: 22.94,18.43 POWER
MANAGER.8 ; 22.94,18.43 22.94,18.44 USB-A.4 ; 22.94,18.43 POWER
MANAGER.7
